# EAGLE design BOCASboard V2.1.3 (EAGLE 5.11)
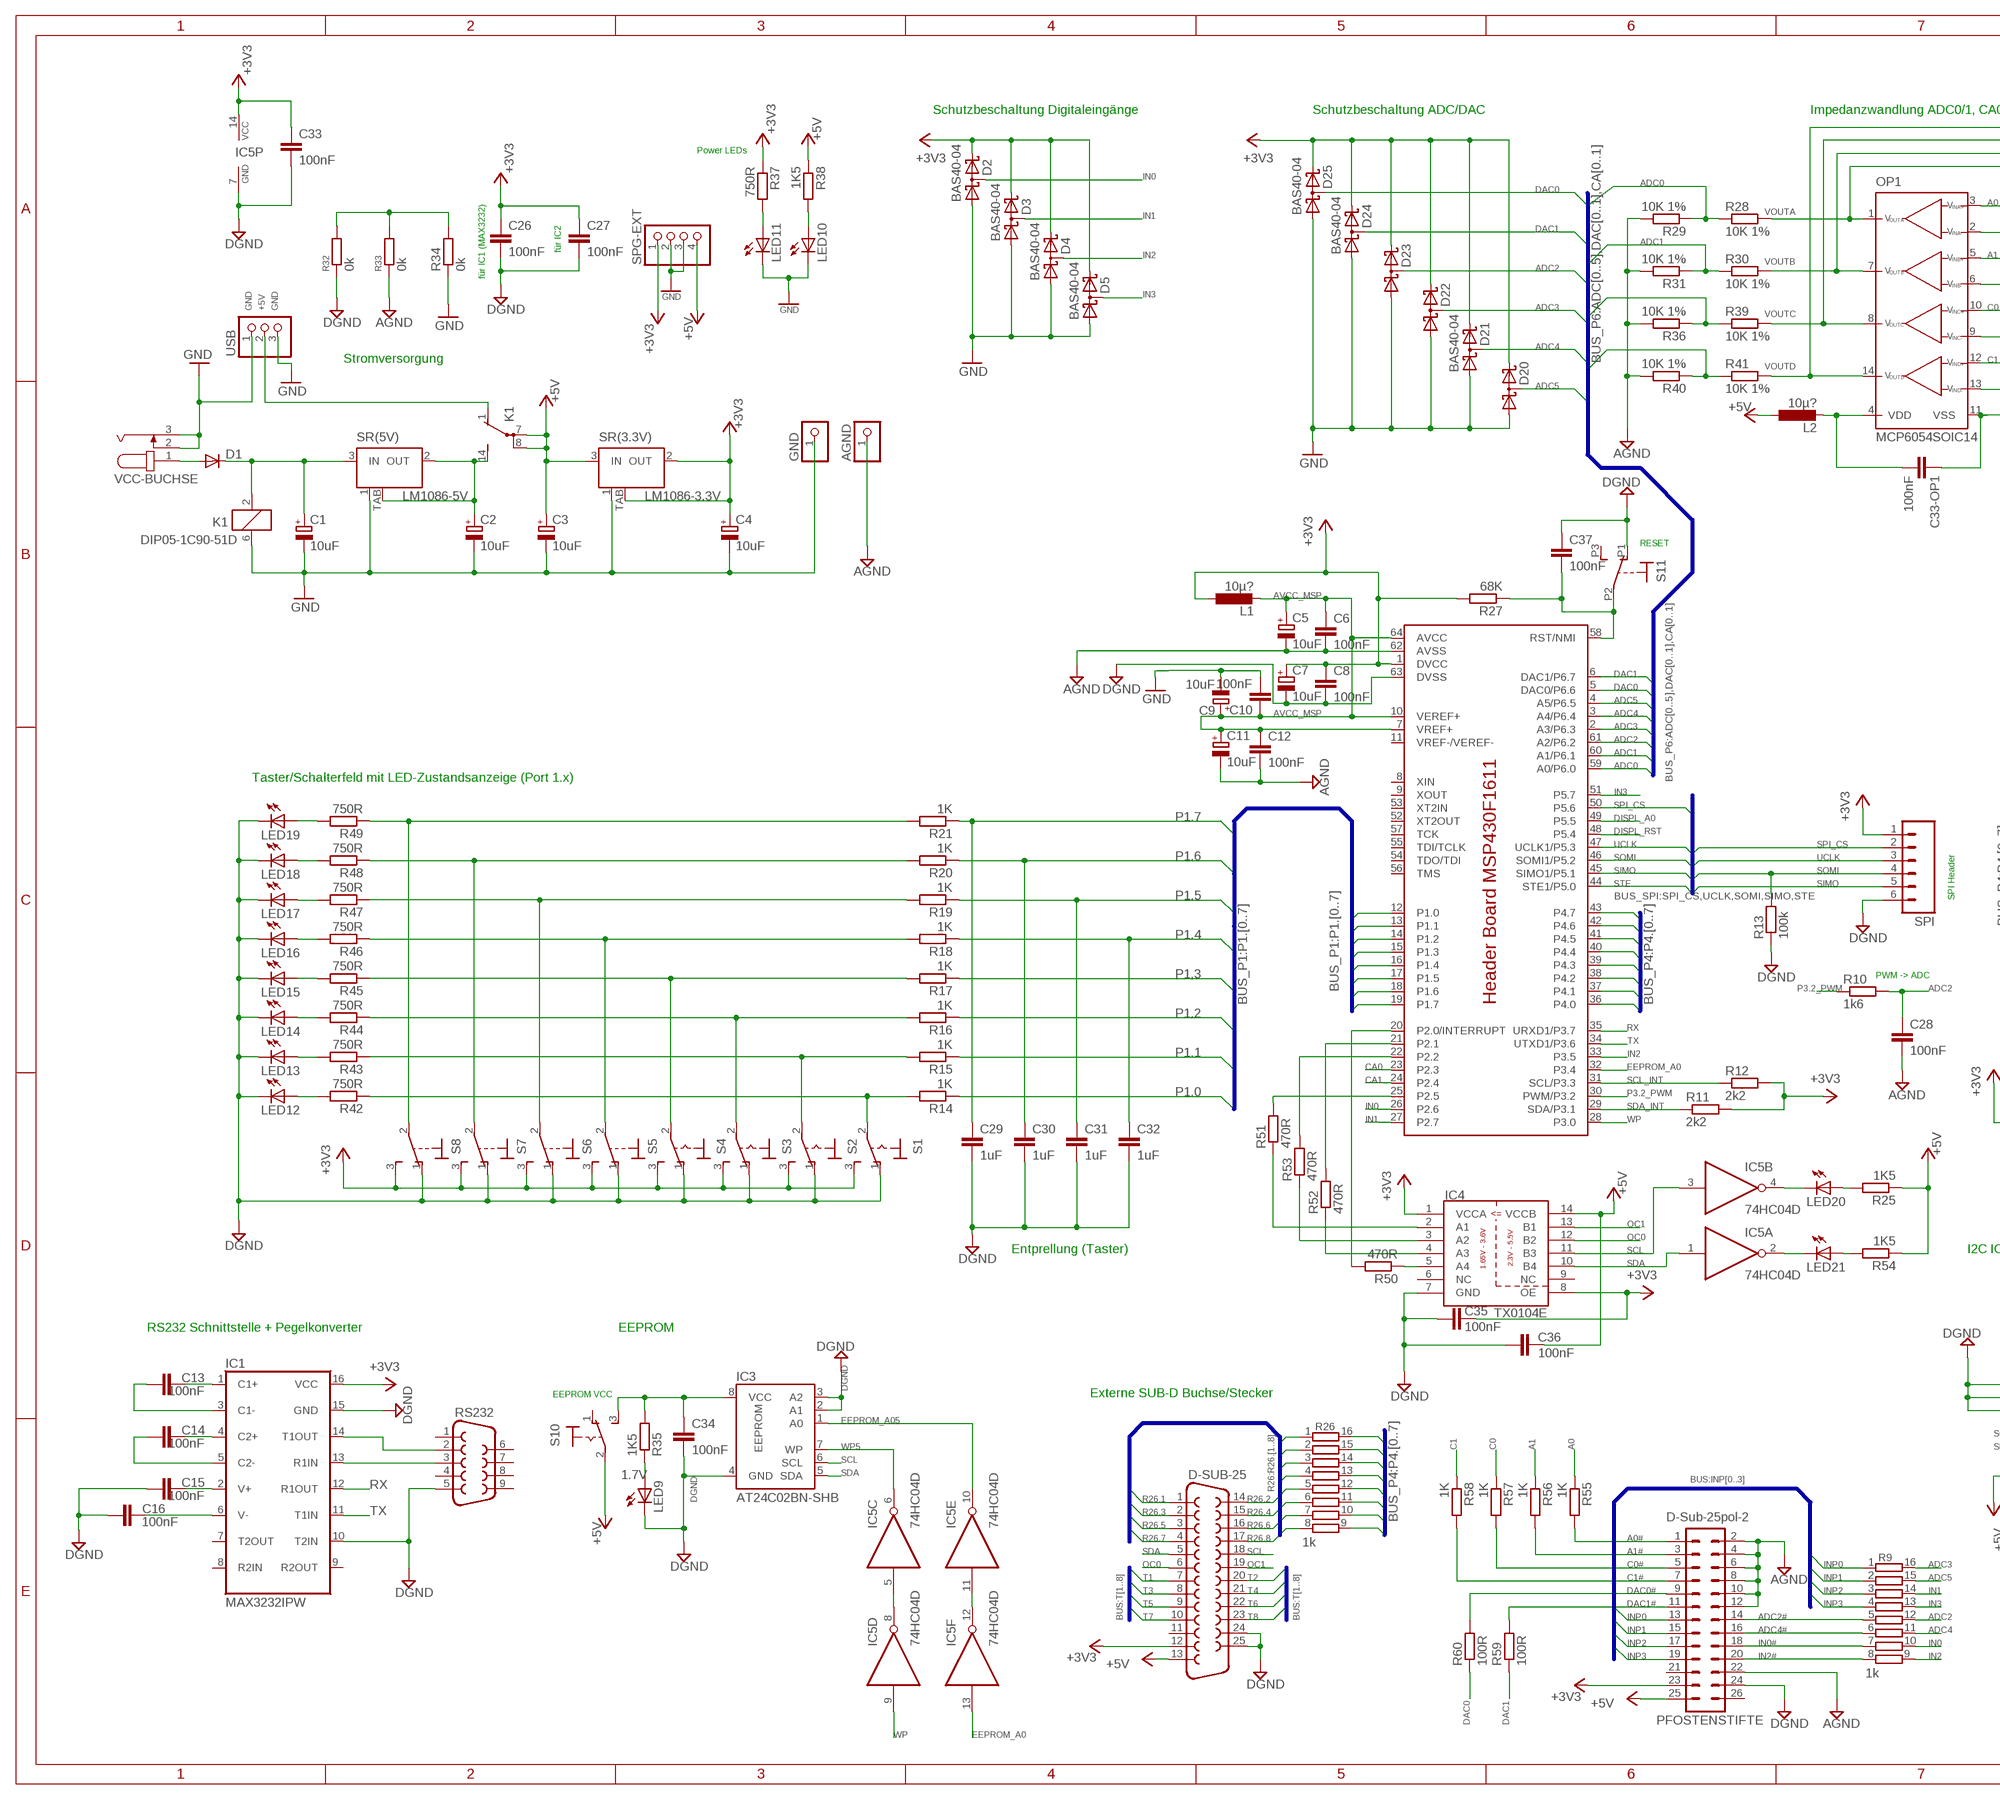
[diagram p0: schematic, sheet 1, part 1 of 2]
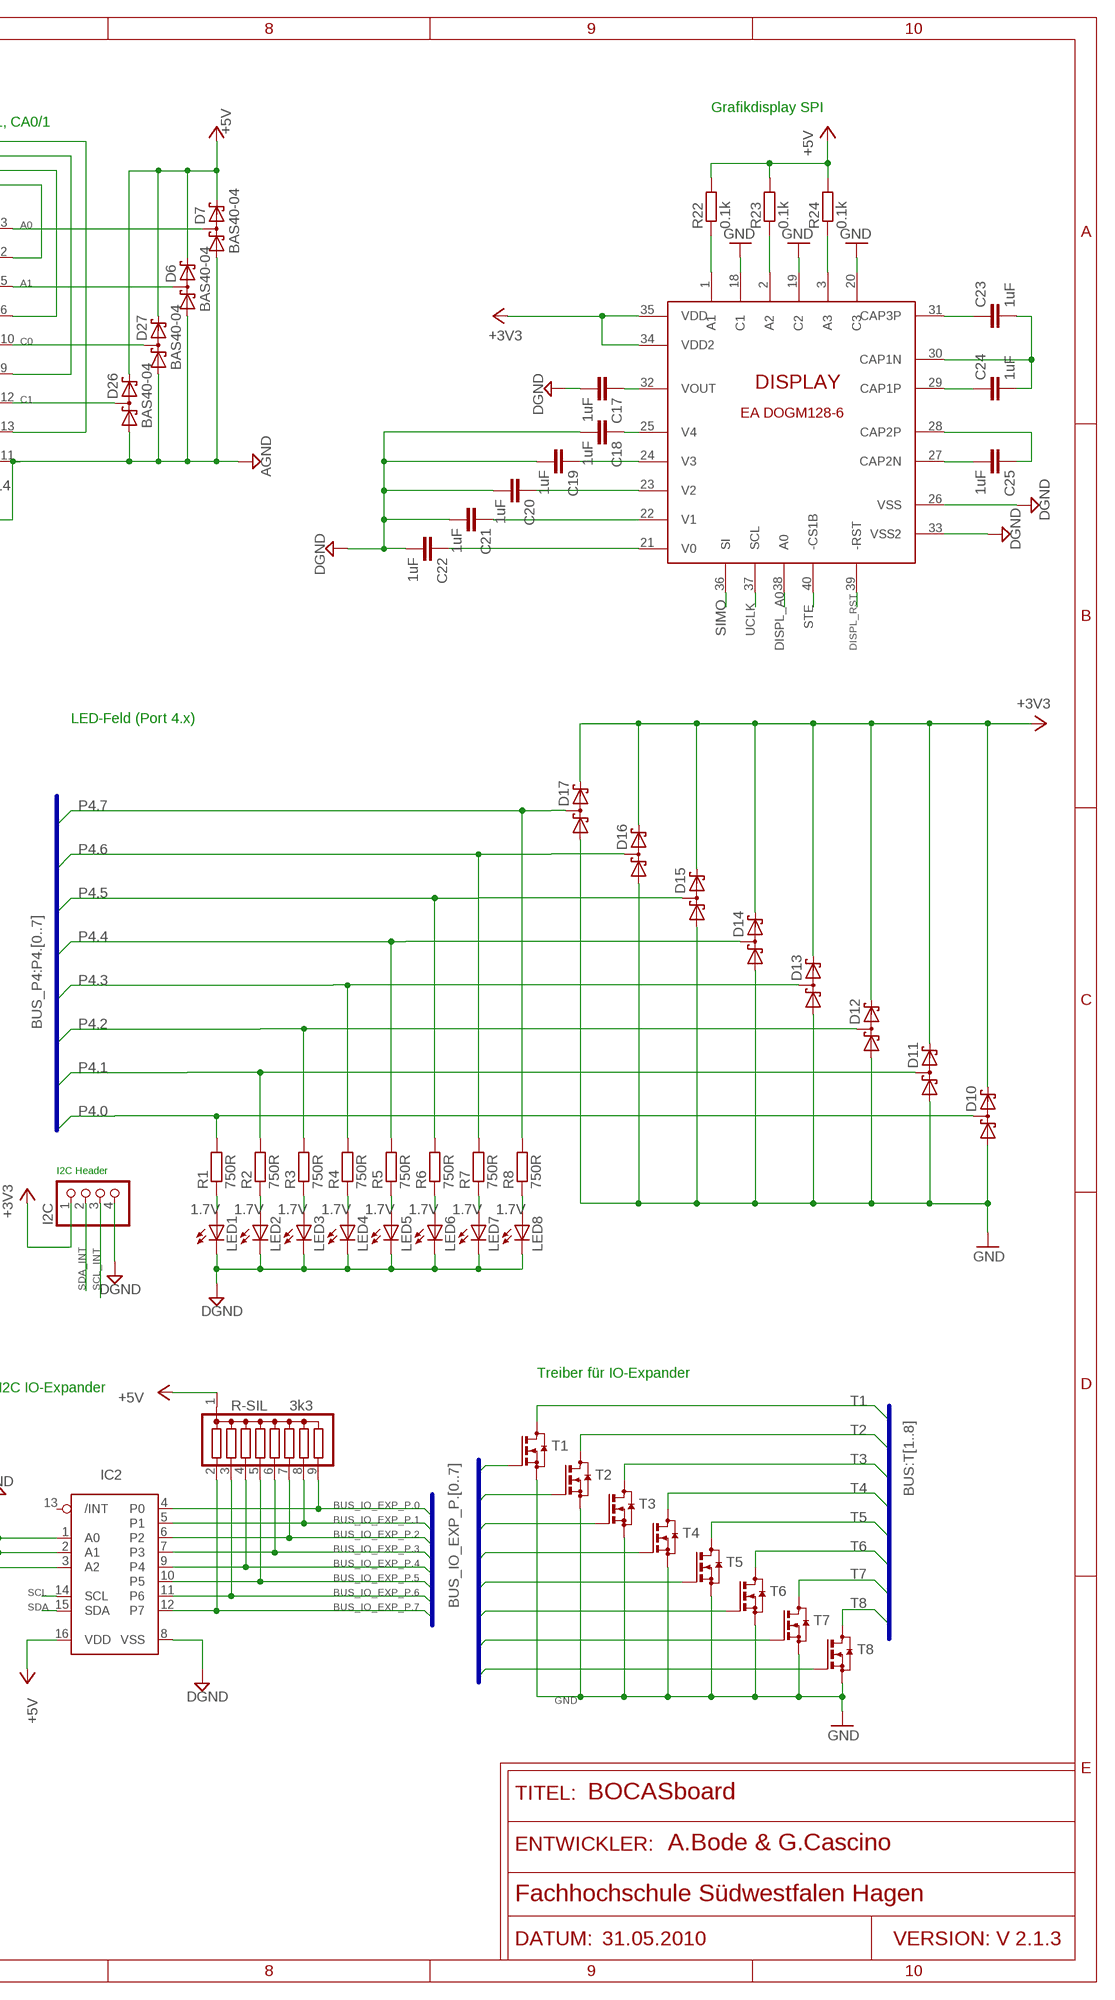
[diagram p1: schematic, sheet 1, part 2 of 2]

## Parts
AGND  PINHD-1X1  [1X01]
C1  10uF  KONDENSATORENCT3216  [CT3216]
C2  10uF  KONDENSATORENCT3216  [CT3216]
C3  10uF  KONDENSATORENCT3216  [CT3216]
C4  10uF  KONDENSATORENCT3216  [CT3216]
C5  10uF  KONDENSATORENCT3216  [CT3216]
C6  100nF  KONDENSATOR-  [R0805]
C7  10uF  KONDENSATORENCT3216  [CT3216]
C8  100nF  KONDENSATOR-  [R0805]
C9  10uF  KONDENSATORENCT3216  [CT3216]
C10  100nF  KONDENSATOR-  [R0805]
C11  10uF  KONDENSATORENCT3216  [CT3216]
C12  100nF  KONDENSATOR-  [R0805]
C13  100nF  KONDENSATOREN-KERAMIK  [C0805]
C14  100nF  KONDENSATOREN-KERAMIK  [C0805]
C15  100nF  KONDENSATOREN-KERAMIK  [C0805]
C16  100nF  KONDENSATOREN-KERAMIK  [C0805]
C17  1uF  KONDENSATOREN-KERAMIK  [C0805]
C18  1uF  KONDENSATOREN-KERAMIK  [C0805]
C19  1uF  KONDENSATOREN-KERAMIK  [C0805]
C20  1uF  KONDENSATOREN-KERAMIK  [C0805]
C21  1uF  KONDENSATOREN-KERAMIK  [C0805]
C22  1uF  KONDENSATOREN-KERAMIK  [C0805]
C23  1uF  KONDENSATOREN-KERAMIK  [C0805]
C24  1uF  KONDENSATOREN-KERAMIK  [C0805]
C25  1uF  KONDENSATOREN-KERAMIK  [C0805]
C26  100nF  KONDENSATOREN-KERAMIK  [C0805]
C27  100nF  KONDENSATOREN-KERAMIK  [C0805]
C28  100nF  KONDENSATOREN-KERAMIK  [C0805]
C29  1uF  KONDENSATOREN-KERAMIK  [C0805]
C30  1uF  KONDENSATOREN-KERAMIK  [C0805]
C31  1uF  KONDENSATOREN-KERAMIK  [C0805]
C32  1uF  KONDENSATOREN-KERAMIK  [C0805]
C33  100nF  KONDENSATOREN-KERAMIK  [C0805]
C33-OP1  100nF  KONDENSATOREN-KERAMIK  [C0805]
C34  100nF  KONDENSATOREN-KERAMIK  [C0805]
C35  100nF  KONDENSATOREN-KERAMIK  [C0805]
C36  100nF  KONDENSATOREN-KERAMIK  [C0805]
C37  100nF  KONDENSATOR-  [R0805]
D1  ES2D  [SMB]
D2  BAS40-04  [SOT23]
D3  BAS40-04  [SOT23]
D4  BAS40-04  [SOT23]
D5  BAS40-04  [SOT23]
D6  BAS40-04  [SOT23]
D7  BAS40-04  [SOT23]
D10  BAS40-04  [SOT23]
D11  BAS40-04  [SOT23]
D12  BAS40-04  [SOT23]
D13  BAS40-04  [SOT23]
D14  BAS40-04  [SOT23]
D15  BAS40-04  [SOT23]
D16  BAS40-04  [SOT23]
D17  BAS40-04  [SOT23]
D20  BAS40-04  [SOT23]
D21  BAS40-04  [SOT23]
D22  BAS40-04  [SOT23]
D23  BAS40-04  [SOT23]
D24  BAS40-04  [SOT23]
D25  BAS40-04  [SOT23]
D26  BAS40-04  [SOT23]
D27  BAS40-04  [SOT23]
D-SUB-25  D-SUB-25H  [F25-HORIZONTAL_2]
DISPLAY  EADOGM128  [EADOGM128]
GND  PINHD-1X1  [1X01]
I2C  PINHD-1X4  [1X04]
IC1  MAX3232IPW  [TSSOP16]
IC2  PCF8574AT  [SO16L]
IC3  AT24C02BN-SHB  [SOIC8]
IC4  TX0104E  TX0104PWR  [TSSOP14]
IC5  74HC04D  [SO14]
K1  DIP05-1C90-51D  [RR1U]
L1  10µ?  L-EUL0805  [R0805]
L2  10µ?  L-EUL0805  [R0805]
LED1  1.7V  LED3MM  [LED3MM]
LED2  1.7V  LED3MM  [LED3MM]
LED3  1.7V  LED3MM  [LED3MM]
LED4  1.7V  LED3MM  [LED3MM]
LED5  1.7V  LED3MM  [LED3MM]
LED6  1.7V  LED3MM  [LED3MM]
LED7  1.7V  LED3MM  [LED3MM]
LED8  1.7V  LED3MM  [LED3MM]
LED9  1.7V  LED3MM  [LED3MM]
LED10  LED  [R0805]
LED11  LED  [R0805]
LED12  LED  [R0805]
LED13  LED  [R0805]
LED14  LED  [R0805]
LED15  LED  [R0805]
LED16  LED  [R0805]
LED17  LED  [R0805]
LED18  LED  [R0805]
LED19  LED  [R0805]
LED20  LED  [R0805]
LED21  LED  [R0805]
OP1  MCP6054SOIC14  [SO14]
PFOSTENSTIFTE  D-Sub-25pol-2  PFOSTENSTIFTE  [ML26]
R1  750R  WIDERSTÄNDE_R0805  [R0805]
R2  750R  WIDERSTÄNDE_R0805  [R0805]
R3  750R  WIDERSTÄNDE_R0805  [R0805]
R4  750R  WIDERSTÄNDE_R0805  [R0805]
R5  750R  WIDERSTÄNDE_R0805  [R0805]
R6  750R  WIDERSTÄNDE_R0805  [R0805]
R7  750R  WIDERSTÄNDE_R0805  [R0805]
R8  750R  WIDERSTÄNDE_R0805  [R0805]
R9  1k  4816P-NETF  [SO16-F]
R10  1k6  WIDERSTÄNDE_R0805  [R0805]
R11  2k2  WIDERSTÄNDE_R0805  [R0805]
R12  2k2  WIDERSTÄNDE_R0805  [R0805]
R13  100k  WIDERSTÄNDE_R0805  [R0805]
R14  1K  WIDERSTÄNDE_R0805  [R0805]
R15  1K  WIDERSTÄNDE_R0805  [R0805]
R16  1K  WIDERSTÄNDE_R0805  [R0805]
R17  1K  WIDERSTÄNDE_R0805  [R0805]
R18  1K  WIDERSTÄNDE_R0805  [R0805]
R19  1K  WIDERSTÄNDE_R0805  [R0805]
R20  1K  WIDERSTÄNDE_R0805  [R0805]
R21  1K  WIDERSTÄNDE_R0805  [R0805]
R22  0.1k  WIDERSTÄNDE_R0805  [R0805]
R23  0.1k  WIDERSTÄNDE_R0805  [R0805]
R24  0.1k  WIDERSTÄNDE_R0805  [R0805]
R25  1K5  WIDERSTÄNDE_R0805  [R0805]
R26  1k  4816P-NETF  [SO16-F]
R27  68K  WIDERSTÄNDE_M0805  [M0805]
R28  10K 1%  WIDERSTÄNDE_R0805  [R0805]
R29  10K 1%  WIDERSTÄNDE_R0805  [R0805]
R30  10K 1%  WIDERSTÄNDE_R0805  [R0805]
R31  10K 1%  WIDERSTÄNDE_R0805  [R0805]
R32  0k  WIDERSTÄNDE_R0805  [R0805]
R33  0k  WIDERSTÄNDE_R0805  [R0805]
R34  0k  WIDERSTÄNDE_R0805  [R0805]
R35  1K5  WIDERSTÄNDE_R0805  [R0805]
R36  10K 1%  WIDERSTÄNDE_R0805  [R0805]
R37  750R  WIDERSTÄNDE_M0805  [M0805]
R38  1K5  WIDERSTÄNDE_M0805  [M0805]
R39  10K 1%  WIDERSTÄNDE_R0805  [R0805]
R40  10K 1%  WIDERSTÄNDE_R0805  [R0805]
R41  10K 1%  WIDERSTÄNDE_R0805  [R0805]
R42  750R  WIDERSTÄNDE_R0805  [R0805]
R43  750R  WIDERSTÄNDE_R0805  [R0805]
R44  750R  WIDERSTÄNDE_R0805  [R0805]
R45  750R  WIDERSTÄNDE_R0805  [R0805]
R46  750R  WIDERSTÄNDE_R0805  [R0805]
R47  750R  WIDERSTÄNDE_R0805  [R0805]
R48  750R  WIDERSTÄNDE_R0805  [R0805]
R49  750R  WIDERSTÄNDE_R0805  [R0805]
R50  470R  WIDERSTÄNDE_R0805  [R0805]
R51  470R  WIDERSTÄNDE_R0805  [R0805]
R52  470R  WIDERSTÄNDE_R0805  [R0805]
R53  470R  WIDERSTÄNDE_R0805  [R0805]
R54  1K5  WIDERSTÄNDE_R0805  [R0805]
R55  1K  WIDERSTÄNDE_R0805  [R0805]
R56  1K  WIDERSTÄNDE_R0805  [R0805]
R57  1K  WIDERSTÄNDE_R0805  [R0805]
R58  1K  WIDERSTÄNDE_R0805  [R0805]
R59  100R  WIDERSTÄNDE_R0805  [R0805]
R60  100R  WIDERSTÄNDE_R0805  [R0805]
R-SIL  3k3  BOURNS-4609  [SIL9]
RS232  D-SUB-09H  [F09-H1]
S1  KIPPSCHALTER  [2MS]
S2  KIPPSCHALTER  [2MS]
S3  KIPPSCHALTER  [2MS]
S4  KIPPSCHALTER  [2MS]
S5  KIPPTASTER  [2MS]
S6  KIPPTASTER  [2MS]
S7  KIPPTASTER  [2MS]
S8  KIPPTASTER  [2MS]
S10  KIPPSCHALTER  [2MS]
S11  RESET-KIPPTASTER  [KIPPTASTER-90]
SPG-EXT  PINHD-1X4  [1X04]
SPI  PFOSTENSTECKER-P06  [PFOSTENSTECKER-P06]
SR(3.3V)  LM1086-3.3V  [TO263-3]
SR(5V)  LM1086-5V  [TO263-3]
T1  N-MOSFET  [SOT346]
T2  N-MOSFET  [SOT346]
T3  N-MOSFET  [SOT346]
T4  N-MOSFET  [SOT346]
T5  N-MOSFET  [SOT346]
T6  N-MOSFET  [SOT346]
T7  N-MOSFET  [SOT346]
T8  N-MOSFET  [SOT346]
U$1  HEADER_BOARD_2  [MCKU]
USB  PINHD-1X3  [1X03]
VCC-BUCHSE  VCC-BUCHSE0  [VCC-BUCHSE-MULTIOCOMP]

## Nets
+3V3 [VCC +3.3V]: C4.+ C7.+ C8.1 C26.1 C27.1 C33.1 C35.1 D2.2(C2) D3.2(C2) D4.2(C2) D5.2(C2) D10.2(C2) D11.2(C2) D12.2(C2) D13.2(C2) D14.2(C2) D15.2(C2) D16.2(C2) D17.2(C2) D20.2(C2) D21.2(C2) D22.2(C2) D23.2(C2) D24.2(C2) D25.2(C2) D-SUB-25.12 DISPLAY.34(VDD2) DISPLAY.35(VDD) I2C.1 IC1.16(VCC) IC4.1(VCCA) IC4.8(OE) IC5.14(P:VCC) L1.1 PFOSTENSTIFTE.23 R11.2 R12.2 R27.2 R37.1 S1.3 S2.3 S3.3 S4.3 S5.3 S6.3 S7.3 S8.3 SPG-EXT.1 SPI.1 SR(3.3V).2(OUT) SR(3.3V).TAB(OUT) U$1.1(DVCC)
+5V [Power]: C3.+ C36.1 D6.2(C2) D7.2(C2) D26.2(C2) D27.2(C2) D-SUB-25.13 IC2.16(VDD) IC4.14(VCCB) K1.7(2:P) K1.8(2:P) L2.1 PFOSTENSTIFTE.25 R22.2 R23.2 R24.2 R25.1 R38.1 R54.1 R-SIL.1 S10.2 SPG-EXT.4 SR(3.3V).3(IN)
A0 [Analog]: D7.3(C1A2) OP1.3(VINA+) R55.1
A0# [Analog]: PFOSTENSTIFTE.1 R55.2
A1 [Analog]: D6.3(C1A2) OP1.5(VINB+) R56.1
A1# [Analog]: PFOSTENSTIFTE.3 R56.2
A2_TX: IC4.4(A3) R52.1
A3_TX: IC4.3(A2) R53.1
A4_TX: IC4.2(A1) R51.1
ADC0: R28.1 R29.1 U$1.59(A0/P6.0)
ADC1: R30.1 R31.1 U$1.60(A1/P6.1)
ADC2 [Analog]: C28.1 D23.3(C1A2) R9.12 R10.2 U$1.61(A2/P6.2)
ADC2#: PFOSTENSTIFTE.14 R9.5
ADC3 [Analog]: D22.3(C1A2) R9.16 U$1.2(A3/P6.3)
ADC4 [Analog]: D21.3(C1A2) R9.11 U$1.3(A4/P6.4)
ADC4#: PFOSTENSTIFTE.16 R9.6
ADC5 [Analog]: D20.3(C1A2) R9.15 U$1.4(A5/P6.5)
AGND [Power]: AGND.1 C5.- C6.2 C11.- C12.2 C28.2 C33-OP1.1 D6.1(A1) D7.1(A1) D26.1(A1) D27.1(A1) OP1.11(VSS) PFOSTENSTIFTE.2 PFOSTENSTIFTE.4 PFOSTENSTIFTE.6 PFOSTENSTIFTE.8 PFOSTENSTIFTE.10 PFOSTENSTIFTE.12 PFOSTENSTIFTE.22 R29.2 R31.2 R33.1 R36.2 R40.2 U$1.62(AVSS)
AVCC_MSP [VCC +3.3V]: C5.+ C6.1 C9.+ C10.1 C11.+ C12.1 L1.2 U$1.7(VREF+) U$1.10(VEREF+) U$1.64(AVCC)
BUS_IO_EXP_P.0 [Digital]: IC2.4(P0) R-SIL.9 T1.1(G)
BUS_IO_EXP_P.1 [Digital]: IC2.5(P1) R-SIL.8 T2.1(G)
BUS_IO_EXP_P.2 [Digital]: IC2.6(P2) R-SIL.7 T3.1(G)
BUS_IO_EXP_P.3 [Digital]: IC2.7(P3) R-SIL.6 T4.1(G)
BUS_IO_EXP_P.4 [Digital]: IC2.9(P4) R-SIL.4 T5.1(G)
BUS_IO_EXP_P.5 [Digital]: IC2.10(P5) R-SIL.5 T6.1(G)
BUS_IO_EXP_P.6: IC2.11(P6) R-SIL.3 T7.1(G)
BUS_IO_EXP_P.7 [Digital]: IC2.12(P7) R-SIL.2 T8.1(G)
C0: D27.3(C1A2) OP1.10(VINC+) R57.1
C0#: PFOSTENSTIFTE.5 R57.2
C1: D26.3(C1A2) OP1.12(VIND+) R58.1
C1#: PFOSTENSTIFTE.7 R58.2
C1+: C13.2 IC1.1(C1+)
C1-: C13.1 IC1.3(C1-)
C2+: C14.2 IC1.4(C2+)
CA0: R36.1 R39.1 U$1.23(P2.3)
CA1: R40.1 R41.1 U$1.24(P2.4)
DAC0: D25.3(C1A2) R60.1 U$1.5(DAC0/P6.6)
DAC0#: PFOSTENSTIFTE.9 R60.2
DAC1: D24.3(C1A2) R59.1 U$1.6(DAC1/P6.7)
DAC1#: PFOSTENSTIFTE.11 R59.2
DGND [Digital]: C7.- C8.2 C15.1 C16.1 C17.2 C18.2 C19.2 C20.2 C21.2 C22.2 C26.2 C27.2 C29.2 C30.2 C31.2 C32.2 C33.2 C34.2 C35.2 C36.2 C37.1 DISPLAY.26(VSS) DISPLAY.33(VSS2) I2C.4 IC1.10(T2IN) IC1.15(GND) IC2.1(A0) IC2.2(A1) IC2.3(A2) IC2.8(VSS) IC3.2(A1) IC3.3(A2) IC3.4(GND) IC4.7(GND) IC5.7(P:GND) LED1.K LED2.K LED3.K LED4.K LED5.K LED6.K LED7.K LED8.K LED9.K LED12.2(K) LED13.2(K) LED14.2(K) LED15.2(K) LED16.2(K) LED17.2(K) LED18.2(K) LED19.2(K) PFOSTENSTIFTE.24 R13.1 R32.1 RS232.5 S1.1 S2.1 S3.1 S4.1 S5.1 S6.1 S7.1 S8.1 S11.P1 SPI.6 U$1.63(DVSS)
DISPL_A0 [Digital]: DISPLAY.38(A0) U$1.49(P5.5)
DISPL_RST [Digital]: DISPLAY.39(-RST) U$1.48(P5.4)
EEPROM_A0 [Digital]: IC5.13(F:I) U$1.32(P3.4)
EEPROM_A05 [Digital]: IC3.1(A0) IC5.10(E:O)
GND [High Strom]: C1.- C2.- C3.- C4.- C9.- C10.2 D2.1(A1) D3.1(A1) D4.1(A1) D5.1(A1) D10.1(A1) D11.1(A1) D12.1(A1) D13.1(A1) D14.1(A1) D15.1(A1) D16.1(A1) D17.1(A1) D20.1(A1) D21.1(A1) D22.1(A1) D23.1(A1) D24.1(A1) D25.1(A1) DISPLAY.18(C1) DISPLAY.19(C2) DISPLAY.20(C3) GND.1 K1.6 LED10.2(K) LED11.2(K) R34.1 SPG-EXT.2 SPG-EXT.3 SR(3.3V).1(GND) SR(5V).1(GND) T1.2(S) T2.2(S) T3.2(S) T4.2(S) T5.2(S) T6.2(S) T7.2(S) T8.2(S) USB.1 USB.3 VCC-BUCHSE.2 VCC-BUCHSE.3
IN0: D2.3(C1A2) R9.10 U$1.26(P2.6)
IN0#: PFOSTENSTIFTE.18 R9.7
IN1: D3.3(C1A2) R9.14 U$1.27(P2.7)
IN2: D4.3(C1A2) R9.9 U$1.33(P3.5)
IN2#: PFOSTENSTIFTE.20 R9.8
IN3: D5.3(C1A2) R9.13 U$1.51(P5.7)
INP0: PFOSTENSTIFTE.13 R9.1
INP1: PFOSTENSTIFTE.15 R9.2
INP2: PFOSTENSTIFTE.17 R9.3
INP3: PFOSTENSTIFTE.19 R9.4
N$1: DISPLAY.1(A1) R22.1
N$2: R14.2 R42.1 S1.2
N$3: LED12.1(A) R42.2
N$4: DISPLAY.2(A2) R23.1
N$5: R50.2 U$1.20(P2.0/INTERRUPT)
N$6: LED19.1(A) R49.2
N$7: DISPLAY.3(A3) R24.1
N$8: LED18.1(A) R48.2
N$9: C23.1 DISPLAY.31(CAP3P)
N$10: LED17.1(A) R47.2
N$11: LED11.1(A) R37.2
N$12: LED10.1(A) R38.2
N$13: LED16.1(A) R46.2
N$14: LED15.1(A) R45.2
N$15: LED14.1(A) R44.2
N$16: C14.1 IC1.5(C2-)
N$17: D1.A VCC-BUCHSE.1
N$18: LED13.1(A) R43.2
N$19: R21.2 R49.1 S8.2
N$20: R20.2 R48.1 S7.2
N$21: R19.2 R47.1 S6.2
N$22: R18.2 R46.1 S5.2
N$23: C22.1 DISPLAY.21(V0)
N$24: C21.1 DISPLAY.22(V1)
N$25: C20.1 DISPLAY.23(V2)
N$26: C19.1 DISPLAY.24(V3)
N$27: LED1.A R1.1
N$28: LED2.A R2.1
N$29: LED3.A R3.1
N$30: LED4.A R4.1
N$31: LED5.A R5.1
N$32: LED6.A R6.1
N$33: LED7.A R7.1
N$34: LED8.A R8.1
N$35: C17.1 DISPLAY.32(VOUT)
N$36: C18.1 DISPLAY.25(V4)
N$37: C24.1 DISPLAY.29(CAP1P)
N$38: C23.2 C24.2 DISPLAY.30(CAP1N)
N$39: C25.2 DISPLAY.27(CAP2N)
N$40: C25.1 DISPLAY.28(CAP2P)
N$41: R17.2 R45.1 S4.2
N$42: R32.2 R33.2 R34.2
N$43: LED9.A R35.1
N$44: R16.2 R44.1 S3.2
N$45: R15.2 R43.1 S2.2
N$46: R52.2 U$1.21(P2.1)
N$47: IC4.5(A4) R50.1
N$48: R51.2 U$1.25(P2.5)
N$50: C15.2 IC1.2(V+)
N$51 [Power]: C33-OP1.2 L2.2 OP1.4(VDD)
N$53: R53.2 U$1.22(P2.2)
N$55: IC5.4(B:O) LED20.2(K)
N$56: IC5.2(A:O) LED21.2(K)
N$57: LED21.1(A) R54.2
N$58: LED20.1(A) R25.2
N$59: IC5.11(E:I) IC5.12(F:O)
N$61: IC5.5(C:I) IC5.8(D:O)
NAME [Digital]: D-SUB-25.24 D-SUB-25.25 ; supply symbol labelled DGND
OC0: D-SUB-25.6 IC4.12(B2)
OC1: D-SUB-25.19 IC4.13(B1)
OUT+5V [Power]: C2.+ K1.14(2:S) SR(5V).2(OUT) SR(5V).TAB(OUT)
P1.0 [Digital]: R14.1 U$1.12(P1.0)
P1.1 [Digital]: R15.1 U$1.13(P1.1)
P1.2 [Digital]: R16.1 U$1.14(P1.2)
P1.3 [Digital]: R17.1 U$1.15(P1.3)
P1.4 [Digital]: C32.1 R18.1 U$1.16(P1.4)
P1.5 [Digital]: C31.1 R19.1 U$1.17(P1.5)
P1.6 [Digital]: C30.1 R20.1 U$1.18(P1.6)
P1.7 [Digital]: C29.1 R21.1 U$1.19(P1.7)
P3.2_PWM [Digital]: R10.1 U$1.30(PWM/P3.2)
P4.0 [Digital]: D10.3(C1A2) R1.2 R26.16 U$1.36(P4.0)
P4.1 [Digital]: D11.3(C1A2) R2.2 R26.15 U$1.37(P4.1)
P4.2 [Digital]: D12.3(C1A2) R3.2 R26.14 U$1.38(P4.2)
P4.3 [Digital]: D13.3(C1A2) R4.2 R26.13 U$1.39(P4.3)
P4.4 [Digital]: D14.3(C1A2) R5.2 R26.12 U$1.40(P4.4)
P4.5 [Digital]: D15.3(C1A2) R6.2 R26.11 U$1.41(P4.5)
P4.6 [Digital]: D16.3(C1A2) R7.2 R26.10 U$1.42(P4.6)
P4.7 [Digital]: D17.3(C1A2) R8.2 R26.9 U$1.43(P4.7)
PWR-5 [Power]: C1.+ D1.C K1.2 SR(5V).3(IN)
R1IN [Digital]: IC1.13(R1IN) RS232.3
R26.1: D-SUB-25.1 R26.1
R26.2: D-SUB-25.14 R26.2
R26.3: D-SUB-25.2 R26.3
R26.4: D-SUB-25.15 R26.4
R26.5: D-SUB-25.3 R26.5
R26.6: D-SUB-25.16 R26.6
R26.7: D-SUB-25.4 R26.7
R26.8: D-SUB-25.17 R26.8
RX [Digital]: IC1.12(R1OUT) U$1.35(URXD1/P3.7)
S10: C37.2 R27.1 S11.P2 U$1.58(RST/NMI)
SCL [Digital]: D-SUB-25.18 IC2.14(SCL) IC3.6(SCL) IC4.11(B3) IC5.3(B:I)
SCL_INT [Digital]: I2C.3 R12.1 U$1.31(SCL/P3.3)
SDA [Digital]: D-SUB-25.5 IC2.15(SDA) IC3.5(SDA) IC4.10(B4) IC5.1(A:I)
SDA_INT [Digital]: I2C.2 R11.1 U$1.29(SDA/P3.1)
SIMO: DISPLAY.36(SI) SPI.5 U$1.45(SIMO1/P5.1)
SOMI: R13.2 SPI.4 U$1.46(SOMI1/P5.2)
SPI_CS: SPI.2 U$1.50(P5.6)
STE: DISPLAY.40(-CS1B) U$1.44(STE1/P5.0)
T1 [High Strom]: D-SUB-25.7 T1.3(D)
T1OUT [Digital]: IC1.14(T1OUT) RS232.2
T2 [High Strom]: D-SUB-25.20 T2.3(D)
T3 [High Strom]: D-SUB-25.8 T3.3(D)
T4 [High Strom]: D-SUB-25.21 T4.3(D)
T5 [High Strom]: D-SUB-25.9 T5.3(D)
T6 [High Strom]: D-SUB-25.22 T6.3(D)
T7 [High Strom]: D-SUB-25.10 T7.3(D)
T8 [High Strom]: D-SUB-25.23 T8.3(D)
TX [Digital]: IC1.11(T1IN) U$1.34(UTXD1/P3.6)
UCLK: DISPLAY.37(SCL) SPI.3 U$1.47(UCLK1/P5.3)
USB [Power]: K1.1(2:O) USB.2
V-: C16.2 IC1.6(V-)
VCC-EEPROM [Digital]: C34.1 IC3.8(VCC) R35.2 S10.3
VOUTA: OP1.1(VOUTA) OP1.2(VINA-) R28.2
VOUTB: OP1.6(VINB-) OP1.7(VOUTB) R30.2
VOUTC: OP1.8(VOUTC) OP1.9(VINC-) R39.2
VOUTD: OP1.13(VIND-) OP1.14(VOUTD) R41.2
WP [Digital]: IC5.9(D:I) U$1.28(P3.0)
WP5 [Digital]: IC3.7(WP) IC5.6(C:O)
Unconnected: D-SUB-25.11 IC1.7(T2OUT) IC1.8(R2IN) IC1.9(R2OUT) IC2.13(/INT) IC4.6(NC) IC4.9(NC) PFOSTENSTIFTE.21 PFOSTENSTIFTE.26 RS232.1 RS232.4 RS232.6 RS232.7 RS232.8 RS232.9 S10.1 S11.P3 U$1.8(XIN) U$1.9(XOUT) U$1.11(VREF-/VEREF-) U$1.52(XT2OUT) U$1.53(XT2IN) U$1.54(TDO/TDI) U$1.55(TDI/TCLK) U$1.56(TMS) U$1.57(TCK)

## Buses
BUS_P1:P1.[0..7]
BUS_IO_EXP_P.[0..7]
BUS_SPI:SPI_CS,UCLK,SOMI,SIMO,STE
BUS:T[1..8]
R26:R26.[1..8]
BUS_P4:P4.[0..7]
BUS_P6:ADC[0..5],DAC[0..1],CA[0..1]
BUS:INP[0..3]

## Notes on the sheet
- Grafikdisplay SPI
- Schutzbeschaltung Digitaleingänge | Schutzbeschaltung ADC/DAC | Impedanzwandlung ADC0/1, CA0/1
- Power LEDs
- für IC2
- für IC1 (MAX3232)
- GND | +5V | GND
- Stromversorgung
- RESET
- LED-Feld (Port 4.x)
- Taster/Schalterfeld mit LED-Zustandsanzeige (Port 1.x)
- SPI Header
- PWM -> ADC
- I2C Header
- Treiber für IO-Expander
- Entprellung (Taster) | I2C IO-Expander
- RS232 Schnittstelle + Pegelkonverter | EEPROM
- EEPROM VCC | Externe SUB-D Buchse/Stecker
- EEPROM
- TITEL: | BOCASboard
- ENTWICKLER: | A.Bode & G.Cascino
- Fachhochschule Südwestfalen Hagen
- DATUM: | 31.05.2010 | VERSION: V 2.1.3

## Library data of the parts
AGND GND = Projekt:PINHD-1X1: PIN HEADER
C1-C5 C7 C9 C11 = Projekt:KONDENSATOREN: POLARIZED CAPACITOR, European symbol
C6 C8 C10 C12 C37 = Projekt:KONDENSATOR-: CAPACITOR, European symbol
C13-C33 C33-OP1 C34-C36 = Projekt:KONDENSATOREN-KERAMIK: Keramik Kondensator,
D1 = Projekt:ES2D: DIODE super fast rectifier, 2 A
D2-D7 D10-D17 D20-D27 = Projekt:BAS40-04: Silicon Schottky Diodes General-purpose diode for high-speed switching
D-SUB-25 = Projekt:D-SUB-25H: Multicomp 5504F1 - Series
DISPLAY = Projekt:EADOGM128
I2C SPG-EXT = Projekt:PINHD-1X4: PIN HEADER
IC1 = Projekt:MAX3232: Texas Instruments RS-232 Transceivers Supply-Current, True +3V to +5.5V
IC2 = Projekt:PCF8574: Remote 8-Bit I/O Expander for I²C Bus
IC3 = Projekt:AT24C*: 2-wire serial EEPROM
IC4 = Projekt:TX0104: TXB0104 or TXS0104 TXB0104 4-BIT BIDIRECTIONAL VOLTAGE-LEVEL TRANSLATOR WITH AUTOMATIC DIRECTION SENSING AND ±15-kV ESD PROTECTION FEATURES 1.2 V to 3.6 V on A Port and 1.65 V to 5.5 V on B Port (VCCA <= VCCB) VCC Isolation Feature - If Either VCC Input Is at GND, All Outputs Are in the High-Impedance State OE Input Circuit Referenced to VCCA Low Power Consumption, 5-uA Max ICC Ioff Supports Partial-Power-Down Mode Operation TXS0104 4-BIT BIDIRECTIONAL VOLTAGE-LEVEL TRANSLATOR FOR OPEN-DRAIN AND PUSH-PULL APPLICATIONS
IC5 = 74xx-eu:74*04: Hex INVERTER
K1 = Projekt:DIP05: REED-RELAY Meder Reed, 1 x Wechselkontakt
L1 L2 = Projekt:L-EU: INDUCTOR, European symbol
LED1-LED21 = Projekt:LED: LED OSRAM: KINGBRIGHT: L-934LSRD 3mm Source: www.kingbright.com
OP1 = Projekt:MCP6054: Operationsverstärker Microchip MCP 6052
PFOSTENSTIFTE = Projekt:PFOSTENSTIFTE: Pfostenstifte
R1-R8 R10-R25 R27-R60 = Projekt:WIDERSTÄNDE_: RESISTOR, European symbol
R9 R26 = Projekt:4816P-NET: BOURNS RESISTOR NETWORK
R-SIL = Projekt:BOURNS-: BOURNS 4609X-SIL Widerstand
RS232 = Projekt:D-SUB-09H
S1-S4 S10 = Projekt:KIPPSCHALTER: MULTICOMP SWITCH Kippschalter ein-ein
S5-S8 = Projekt:KIPPTASTER: MULTICOMP SWITCH Kipptaster ein-tast
S11 = Projekt:RESET-KIPPTASTER: Multicomp Kipptaster gewinkelt, ein-tast
SPI = Projekt:PFOSTENSTECKER-P06
SR(3.3V) = Projekt:LM1086-3.3V: National Semiconductor LM1086-3.3V 1.5A Low Dropout Positive Regulators
SR(5V) = Projekt:LM1086-5V: National Semiconductor LM1086-5V 1.5A Low Dropout Positive Regulators
T1-T8 = Projekt:N-MOSFET: Sanyo CPH3430 N-CHANNEL MOSFET
U$1 = Projekt:HEADER_BOARD_2: Texas Instruments MSP430F1611
USB = Projekt:PINHD-1X3: PIN HEADER
VCC-BUCHSE = Projekt:VCC-BUCHSE: DC Buchse 2.35mm Multicomp

## Net classes
1 Power: width 0.61 mm, drill 0.406 mm, clearance 0.203 mm
2 High Strom: width 1.016 mm, drill 0.508 mm, clearance 0.203 mm
3 Digital: width 0.152 mm, drill 0.305 mm, clearance 0.152 mm
4 Analog: width 0.508 mm, drill 0.305 mm, clearance 0.203 mm
5 VCC +3.3V: width 0.406 mm, drill 0.305 mm, clearance 0.203 mm

## Board
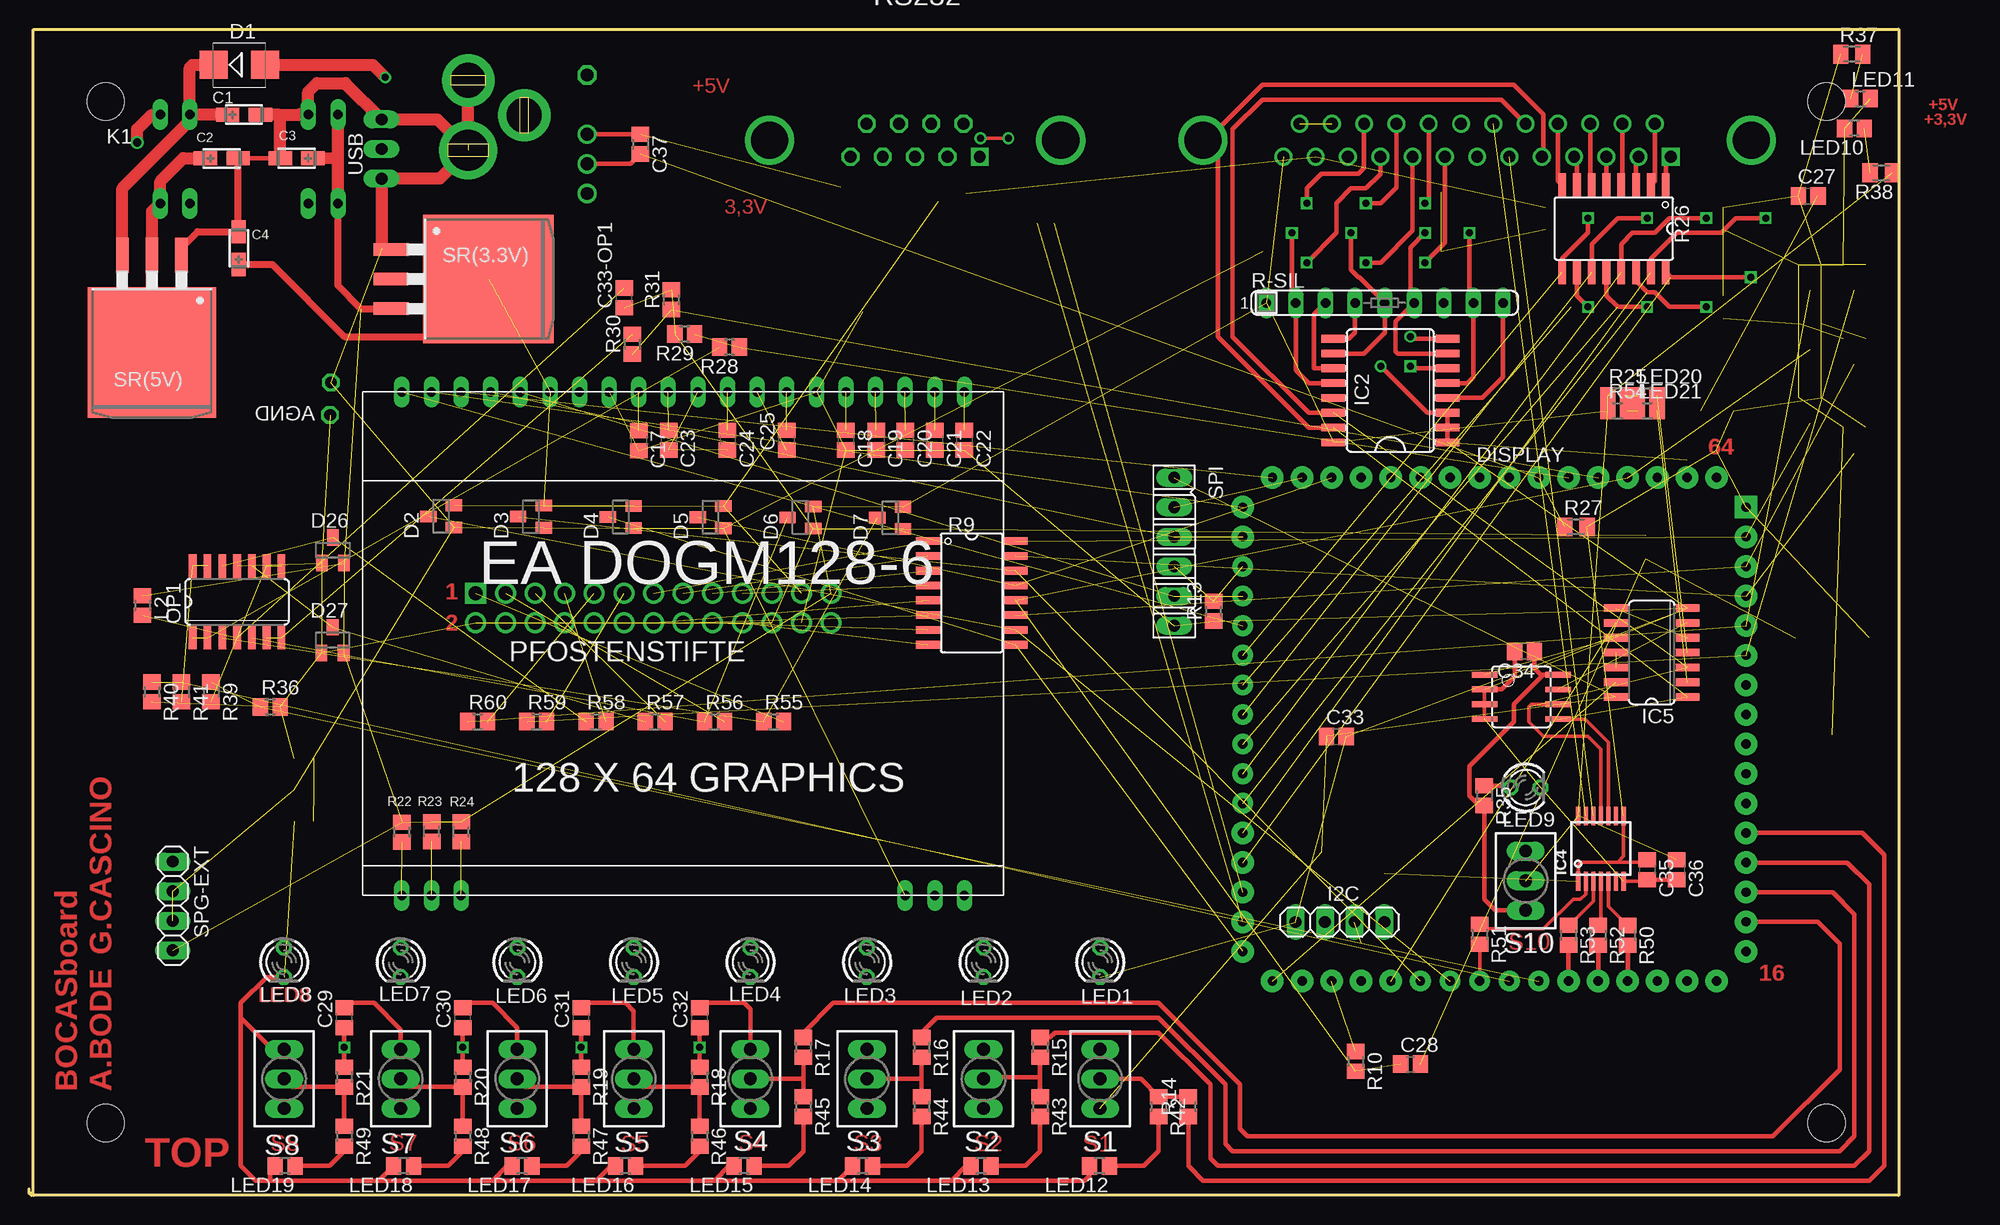
[diagram p2: board, top side]
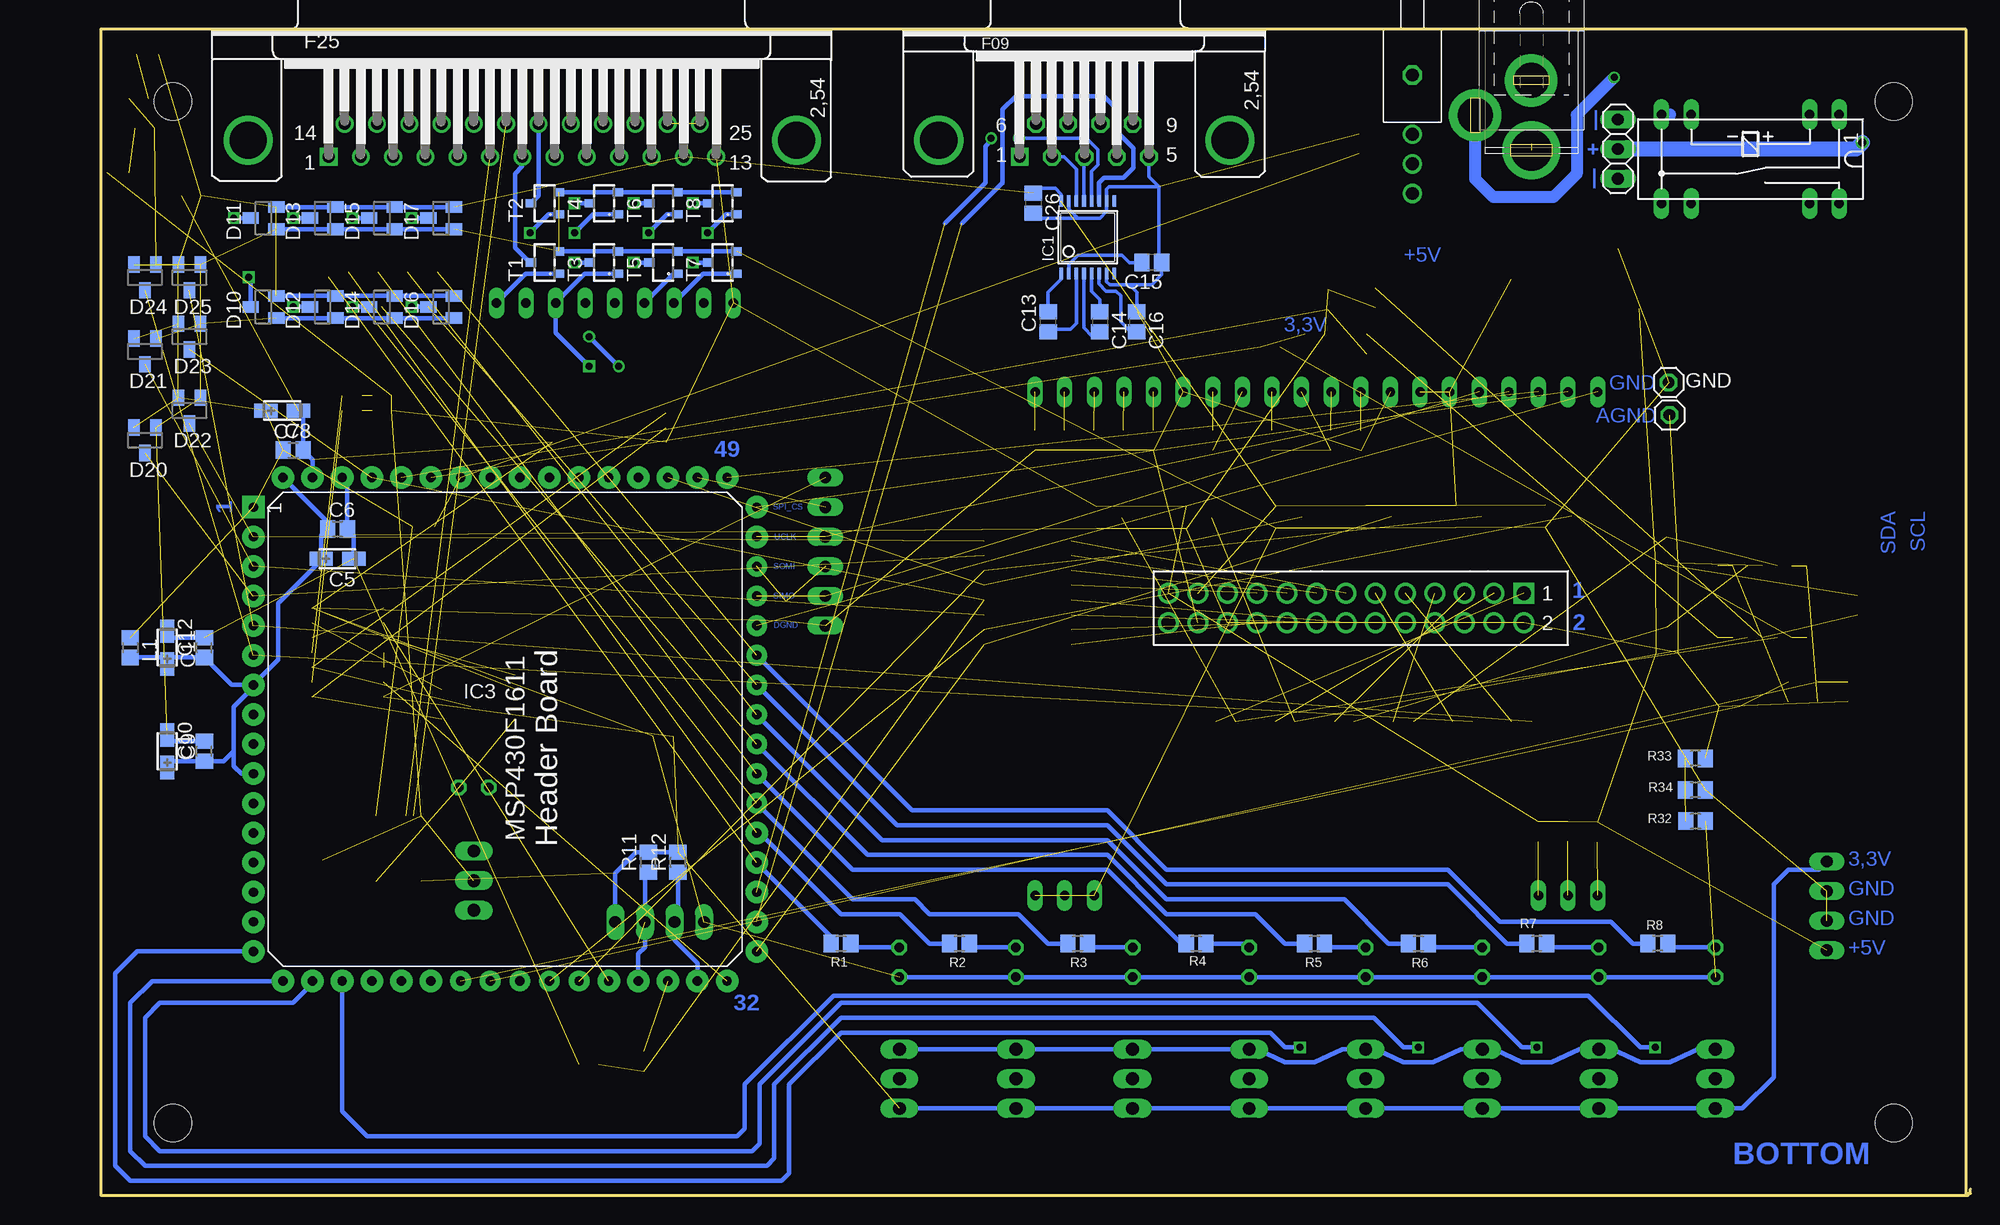
[diagram p3: board, bottom side, seen from below]

Size 160.37 x 100.02 mm. Coordinates in mm from the lower left corner, seen from the top.
Outline: 160.37,100 0.37,100
Outline: 0.37,0 0.37,100
Outline: 0.37,100 160.34,100.02 160.37,100
Outline: 160.37,100 160.37,0 0.37,0
Outline: 0.37,0 0.18,0 0.18,0.18 0,0.18 0,0.56
Copper layers (1*16): Top 0.035mm / dielectric 1.5mm / Bottom 0.035mm
Design rules "default *": minimum track width 6mil, minimum drill 12mil, track to track 8mil, track to pad 8mil, pad to pad 8mil, via to via 8mil, smd to smd 8mil, copper to edge 40mil, drill to drill 8mil, minimum pad ring 10mil, minimum via ring 8mil, stop-mask expansion 4mil, vias tented up to drill 0mil, thermal gap 10mil
Holes 3.2 mm at 6.57,93.8 6.57,6.2 154.17,6.2 154.17,93.8

### Footprints (pad centres in the part's own frame; a part is rotated, then mirrored left to right if it is on the bottom)
1X01 = drill 1.016 octagon: 1 0,0
CT3216 = smd 2 x 1.2: + 1.4,0; - -1.4,0
R0805 = smd 1.3 x 1.5: 1 -0.85,0; 2 0.85,0
C0805 = smd 1.3 x 1.5: 1 -0.85,0; 2 0.85,0
SMB = smd 2.4 x 2.4: A 2.2,0; C -2.2,0
SOT23 = smd 1 x 1.4: 1 -0.95,-1.1; 2 0.95,-1.1; 3 0,1.1
F25-HORIZONTAL_2 = drill 1.016 square: 1 16.62,10.92 | drill 1.016 round: 2 13.85,10.92; 3 11.08,10.92; 4 8.31,10.92; 5 5.54,10.92; 6 2.77,10.92; 7 0,10.92; 8 -2.77,10.92; 9 -5.54,10.92; 10 -8.31,10.92; 11 -11.08,10.92; 12 -13.85,10.92; 13 -16.62,10.92; 14 15.235,8.08; 15 12.465,8.08; 16 9.695,8.08; 17 6.925,8.08; 18 4.155,8.08; 19 1.385,8.08; 20 -1.385,8.08; 21 -4.155,8.08; 22 -6.925,8.08; 23 -9.695,8.08; 24 -12.465,8.08; 25 -15.235,8.08 | drill 3.2 round: P$1 -23.52,9.5; P$2 23.52,9.5
EADOGM128 = drill 0.8 long: 1 -24.13,-21.59; 2 -21.59,-21.59; 3 -19.05,-21.59; 18 19.05,-21.59; 19 21.59,-21.59; 20 24.13,-21.59; 21 24.13,21.59; 22 21.59,21.59; 23 19.05,21.59; 24 16.51,21.59; 25 13.97,21.59; 26 11.43,21.59; 27 8.89,21.59; 28 6.35,21.59; 29 3.81,21.59; 30 1.27,21.59; 31 -1.27,21.59; 32 -3.81,21.59; 33 -6.35,21.59; 34 -8.89,21.59; 35 -11.43,21.59; 36 -13.97,21.59; 37 -16.51,21.59; 38 -19.05,21.59; 39 -21.59,21.59; 40 -24.13,21.59
1X04 = drill 1.016 long: 1 -3.81,0; 2 -1.27,0; 3 1.27,0; 4 3.81,0
TSSOP16 = smd 0.305 x 0.991: 1 -2.275,-3.1; 2 -1.625,-3.1; 3 -0.975,-3.1; 4 -0.325,-3.1; 5 0.325,-3.1; 6 0.975,-3.1; 7 1.625,-3.1; 8 2.275,-3.1; 9 2.275,3.1; 10 1.625,3.1; 11 0.975,3.1; 12 0.325,3.1; 13 -0.325,3.1; 14 -0.975,3.1; 15 -1.625,3.1; 16 -2.275,3.1
SO16L = smd 0.66 x 2.032: 1 -4.445,-4.902; 2 -3.175,-4.902; 3 -1.905,-4.902; 4 -0.635,-4.902; 5 0.635,-4.902; 6 1.905,-4.902; 7 3.175,-4.902; 8 4.445,-4.902; 9 4.445,4.902; 10 3.175,4.902; 11 1.905,4.902; 12 0.635,4.902; 13 -0.635,4.902; 14 -1.905,4.902; 15 -3.175,4.902; 16 -4.445,4.902
SOIC8 = smd 0.5 x 2.2: 1 -1.905,-3.154; 2 -0.645,-3.154; 3 0.625,-3.154; 4 1.895,-3.154; 5 1.905,3.154; 6 0.635,3.154; 7 -0.635,3.154; 8 -1.905,3.154
TSSOP14 = smd 0.35 x 1.6: 1 -1.95,-2.8; 2 -1.3,-2.8; 3 -0.65,-2.8; 4 0,-2.8; 5 0.65,-2.8; 6 1.3,-2.8; 7 1.95,-2.8; 8 1.95,2.8; 9 1.3,2.8; 10 0.65,2.8; 11 0,2.8; 12 -0.65,2.8; 13 -1.3,2.8; 14 -1.95,2.8
SO14 = smd 0.66 x 2.032: 1 -3.81,-3.073; 2 -2.54,-3.073; 3 -1.27,-3.073; 4 0,-3.073; 5 1.27,-3.073; 6 2.54,-3.073; 7 3.81,-3.073; 8 3.81,3.073; 9 2.54,3.073; 10 1.27,3.073; 11 0,3.073; 12 -1.27,3.073; 13 -2.54,3.073; 14 -3.81,3.073
RR1U = drill 0.813 long: 1 -7.62,-3.81; 2 -5.08,-3.81; 6 5.08,-3.81; 7 7.62,-3.81; 8 7.62,3.81; 9 5.08,3.81; 13 -5.08,3.81; 14 -7.62,3.81
LED3MM = drill 0.813 octagon: A -1.27,0; K 1.27,0
ML26 = drill 1.2 square: 1 -15.24,-1.27 | drill 1.2 round: 2 -15.24,1.27; 3 -12.7,-1.27; 4 -12.7,1.27; 5 -10.16,-1.27; 6 -10.16,1.27; 7 -7.62,-1.27; 8 -7.62,1.27; 9 -5.08,-1.27; 10 -5.08,1.27; 11 -2.54,-1.27; 12 -2.54,1.27; 13 0,-1.27; 14 0,1.27; 15 2.54,-1.27; 16 2.54,1.27; 17 5.08,-1.27; 18 5.08,1.27; 19 7.62,-1.27; 20 7.62,1.27; 21 10.16,-1.27; 22 10.16,1.27; 23 12.7,-1.27; 24 12.7,1.27; 25 15.24,-1.27; 26 15.24,1.27
SO16-F = smd 0.66 x 2.032: 1 -4.445,-3.748; 2 -3.175,-3.748; 3 -1.905,-3.748; 4 -0.635,-3.748; 5 0.635,-3.748; 6 1.905,-3.748; 7 3.175,-3.748; 8 4.445,-3.748; 9 4.445,3.748; 10 3.175,3.748; 11 1.905,3.748; 12 0.635,3.748; 13 -0.635,3.748; 14 -1.905,3.748; 15 -3.175,3.748; 16 -4.445,3.748
M0805 = smd 1.3 x 1.6: 1 -0.95,0; 2 0.95,0
SIL9 = drill 0.813 long: 1 -10.16,0; 2 -7.62,0; 3 -5.08,0; 4 -2.54,0; 5 0,0; 6 2.54,0; 7 5.08,0; 8 7.62,0; 9 10.16,0
F09-H1 = drill 1.016 square: 1 5.54,10.92 | drill 1.016 octagon: 2 2.77,10.92; 3 0,10.92; 4 -2.77,10.92; 5 -5.54,10.92; 6 4.155,8.08; 7 1.385,8.08; 8 -1.385,8.08; 9 -4.155,8.08 | drill 3.2 round: P$1 -12.495,9.5; P$2 12.495,9.5
2MS = drill 1.1 pad 1.422 long: 1 -2.54,0; 2 0,0; 3 2.54,0
KIPPTASTER-90 = drill 1.1 round: P1 0,2.54; P2 0,5.08; P3 0,7.62 | drill 1.1 octagon: P$4 0,-2.54
PFOSTENSTECKER-P06 = drill 1.016 long: 1 -6.35,0; 2 -3.81,0; 3 -1.27,0; 4 1.27,0; 5 3.81,0; 6 6.35,0
TO263-3 = smd 1.067 x 3: 1 -2.54,-5.791; 2 0,-5.791; 3 2.54,-5.791 | smd 11 x 11.2: TAB 0,2.54
SOT346 = smd 0.7 x 0.9: 1 -0.95,-1.2; 2 0.95,-1.2; 3 0,1.2
MCKU = drill 0.8 pad 1.93 square: 1 -22.86,-20.32 | drill 0.8 pad 1.93 round: 2 -20.32,-20.32; 3 -17.78,-20.32; 4 -15.24,-20.32; 5 -12.7,-20.32; 6 -10.16,-20.32; 7 -7.62,-20.32; 8 -5.08,-20.32; 9 -2.54,-20.32; 10 0,-20.32; 11 2.54,-20.32; 12 5.08,-20.32; 13 7.62,-20.32; 14 10.16,-20.32; 15 12.7,-20.32; 16 15.24,-20.32; 17 17.78,-17.78; 18 17.78,-15.24; 19 17.78,-12.7; 20 17.78,-10.16; 21 17.78,-7.62; 22 17.78,-5.08; 28 17.78,10.16; 29 17.78,12.7; 30 17.78,15.24; 31 17.78,17.78; 32 17.78,20.32; 33 15.24,22.86; 34 12.7,22.86; 35 10.16,22.86; 36 7.62,22.86; 37 5.08,22.86; 47 -20.32,22.86; 48 -22.86,22.86; 49 -25.4,20.32; 50 -25.4,17.78; 51 -25.4,15.24; 52 -25.4,12.7; 53 -25.4,10.16; 54 -25.4,7.62; 55 -25.4,5.08; 56 -25.4,2.54; 57 -25.4,0; 58 -25.4,-2.54; 59 -25.4,-5.08; 60 -25.4,-7.62; 61 -25.4,-10.16; 62 -25.4,-12.7; 63 -25.4,-15.24; 64 -25.4,-17.78 | drill 0.8 pad 1.778 round: 23 17.78,-2.54; 24 17.78,0; 25 17.78,2.54; 26 17.78,5.08; 27 17.78,7.62; 38 2.54,22.86; 39 0,22.86; 40 -2.54,22.86; 41 -5.08,22.86; 42 -7.62,22.86; 43 -10.16,22.86; 44 -12.7,22.86; 45 -15.24,22.86; 46 -17.78,22.86
1X03 = drill 1.016 long: 1 -2.54,0; 2 0,0; 3 2.54,0
VCC-BUCHSE-MULTIOCOMP = drill 3 pad 4.5 round: 1 0,-4.8; 2 -3,0 | drill 3.5 pad 5 round: 3 3,0

### Placement (x,y rotation side)
AGND  25.81,66.93 0 bottom
C1  18.43,92.7 180 top
C2  16.53,88.93 180 top
C3  22.95,88.95 0 top
C4  17.98,81.25 270 top
C5  140.07,54.61 180 bottom
C6  140.07,57.15 0 bottom
C7  144.81,67.31 180 bottom
C8  143.87,63.92 0 bottom
C9  154.67,38.1 270 bottom
C10  151.5,38.1 90 bottom
C11  154.67,46.99 270 bottom
C12  151.5,46.99 90 bottom
C13  79.11,74.93 90 bottom
C14  74.66,74.93 270 bottom
C15  70.22,80.01 180 bottom
C16  71.49,74.93 270 bottom
C17  52.29,64.73 270 top
C18  70.06,64.78 270 top
C19  72.65,64.78 270 top
C20  75.17,64.78 270 top
C21  77.69,64.78 270 top
C22  80.23,64.78 270 top
C23  54.86,64.78 270 top
C24  59.91,64.78 270 top
C25  64.98,64.78 90 top
C26  80.38,85.09 270 bottom
C27  152.6,85.73 0 top
C28  118.5,11.26 0 top
C29  27.04,15.24 90 top
C30  37.2,15.24 90 top
C31  47.36,15.24 90 top
C32  57.52,15.24 90 top
C33  112.13,39.37 0 top
C33-OP1  51.05,76.97 90 top
C34  128.28,46.64 180 top
C35  138.8,27.94 270 top
C36  141.34,27.94 270 top
C37  52.44,90.17 270 top
D1  18.05,96.97 0 top
D2  35.34,58.24 90 top
D3  43.05,58.22 90 top
D4  50.75,58.19 90 top
D5  58.46,58.17 90 top
D6  66.16,58.14 90 top
D7  73.87,58.12 90 top
D10  146.42,76.2 90 bottom
D11  146.42,83.82 90 bottom
D12  141.34,76.2 90 bottom
D13  141.34,83.82 90 bottom
D14  136.26,76.2 90 bottom
D15  136.26,83.82 90 bottom
D16  131.18,76.2 90 bottom
D17  131.18,83.82 90 bottom
D20  156.58,64.77 180 bottom
D21  156.58,72.39 180 bottom
D22  152.77,67.31 180 bottom
D23  152.77,73.66 180 bottom
D24  156.58,78.74 180 bottom
D25  152.77,78.74 180 bottom
D26  26.06,55.34 0 top
D27  26.03,47.63 0 top
D-SUB-25  124.21,100 180 bottom
DISPLAY  56.1,47.32 0 top
GND  25.88,69.72 0 bottom
I2C  112.43,23.45 180 top
IC1  75.71,82.18 0 bottom
IC2  116.77,69.03 90 top
IC3  128,42.76 270 top
IC4  134.82,29.75 0 top
IC5  139.19,46.56 90 top
K1  18.87,88.9 180 bottom
L1  157.85,46.99 270 bottom
L2  9.72,50.6 270 top
LED1  91.87,20 270 top
LED2  81.87,20 270 top
LED3  71.87,20 270 top
LED4  61.87,20 270 top
LED5  51.87,20 270 top
LED6  41.87,20 270 top
LED7  31.87,20 270 top
LED8  21.87,20 270 top
LED9  128.37,35 0 top
LED10  156.58,91.52 180 top
LED11  157.09,94.06 0 top
LED12  91.81,2.54 180 top
LED13  81.65,2.54 180 top
LED14  71.49,2.54 180 top
LED15  61.33,2.54 180 top
LED16  51.17,2.54 180 top
LED17  42.28,2.54 180 top
LED18  32.12,2.54 180 top
LED19  21.96,2.54 180 top
LED20  138.8,68.58 0 top
LED21  138.8,67.31 0 top
OP1  17.84,50.91 0 top
PFOSTENSTIFTE  53.56,50.37 180 bottom
R1  96.89,21.59 180 bottom
R2  86.73,21.59 180 bottom
R3  76.57,21.59 180 bottom
R4  66.41,21.59 180 bottom
R5  56.25,21.59 180 bottom
R6  47.36,21.59 180 bottom
R7  37.2,21.59 180 bottom
R8  26.81,21.6 180 bottom
R9  80.86,51.68 270 top
R10  113.79,11.5 270 top
R11  113.4,28.57 90 bottom
R12  110.86,28.57 90 bottom
R13  101.61,50.11 90 top
R14  99.43,7.62 90 top
R15  86.73,12.7 270 top
R16  76.57,12.7 270 top
R17  66.41,12.7 270 top
R18  57.52,10.16 270 top
R19  47.36,10.16 270 top
R20  37.2,10.16 270 top
R21  27.04,10.16 270 top
R22  31.98,31.16 90 top
R23  34.53,31.21 90 top
R24  37.06,31.19 90 top
R25  136.26,68.58 0 top
R26  135.94,82.92 180 top
R27  132.69,57.33 0 top
R28  60.07,72.75 180 top
R29  56.24,73.87 180 top
R30  51.76,73.01 90 top
R31  55.1,76.83 90 top
R32  23.57,32.1 180 bottom
R33  23.59,37.49 180 bottom
R34  23.59,34.78 180 bottom
R35  124.83,34.29 270 top
R36  20.69,41.91 0 top
R37  156.34,97.87 0 top
R38  158.87,87.71 180 top
R39  15.61,43.18 270 top
R40  10.53,43.18 270 top
R41  13.07,43.18 270 top
R42  96.89,7.62 270 top
R43  86.73,7.62 270 top
R44  76.57,7.62 270 top
R45  66.41,7.62 270 top
R46  57.52,5.08 270 top
R47  47.36,5.08 270 top
R48  37.2,5.08 270 top
R49  27.04,5.08 270 top
R50  137.12,22.3 270 top
R51  124.43,22.41 270 top
R52  134.58,22.32 270 top
R53  132.04,22.33 270 top
R54  136.26,67.31 0 top
R55  63.87,40.64 0 top
R56  58.79,40.64 0 top
R57  53.71,40.64 0 top
R58  48.63,40.64 0 top
R59  43.55,40.64 0 top
R60  38.47,40.64 0 top
R-SIL  116.28,76.56 0 top
RS232  76,100 180 bottom
S1  91.87,10 270 top
S2  81.87,10 270 top
S3  71.87,10 270 top
S4  61.87,10 270 top
S5  51.87,10 270 top
S6  41.87,10 270 top
S7  31.87,10 270 top
S8  21.87,10 270 top
S10  128.37,27 270 top
S11  47.87,93.55 180 bottom
SPG-EXT  12.32,24.83 270 top
SPI  98.22,55.22 270 top
SR(3.3V)  36.86,78.59 270 top
SR(5V)  10.53,74.84 180 top
T1  122.29,80.01 90 bottom
T2  122.29,85.09 90 bottom
T3  117.21,80.01 90 bottom
T4  117.21,85.09 90 bottom
T5  112.13,80.01 90 bottom
T6  112.13,85.09 90 bottom
T7  107.05,80.01 90 bottom
T8  107.05,85.09 90 bottom
U$1  126.97,36.17 270 bottom
USB  30.22,89.74 270 bottom
VCC-BUCHSE  37.66,92.64 270 bottom

### Tracks (layer width: path | path; a pad name or v marks a point on that pad's centre or on a via)
+3V3  (30 unrouted)
  Top 0.305: IC4.1 132.87,28.36 133.08,28.57 136.26,28.57 | 136.26,28.57 138.58,28.57 C35.1 | IC4.8 136.77,29.09 136.26,28.57
  Top 0.406: 34.46,73.66 SR(3.3V).TAB
  Top 0.61: C4.+ 20.85,79.84 27.04,73.66 34.46,73.66
  Top 1.016: SR(3.3V).TAB SR(3.3V).2
  Bottom 0.305: IC1.16 77.99,85.87 78.47,86.36 79.96,86.36 C26.1
  Bottom 0.406: S1.3 S2.3 S3.3 S4.3 S5.3 S6.3 S7.3 S8.3 19.58,7.46 16.88,10.16 16.88,26.67 15.61,27.94 13.02,27.94 SPG-EXT.1 | D16.2 D14.2 D12.2 D10.2 | D11.2 D13.2 D15.2 D17.2 | R12.2 R11.2 114.45,29.43 116.24,27.64 I2C.1
+5V  (19 unrouted)
  Top 0.61: K1.8 26.49,78.02 28.46,76.05 SR(3.3V).3
  Top 1.016: K1.7 K1.8 26.5,88.9 C3.+
  Bottom 1.016: K1.7 25.77,92.71
A0  (2 unrouted)
A0#  (1 unrouted)
A1  (2 unrouted)
A1#  (1 unrouted)
A2_TX
  Top 0.305: 134.17,23.58 R52.1 134.82,23.42 IC4.4
A3_TX
  Top 0.305: IC4.3 134.17,25.22 132.13,23.18 R53.1
A4_TX
  Top 0.305: R51.1 124.83,22.86 129.91,22.86 132.45,25.4 133.08,25.4 133.52,25.84 IC4.2
ADC0  (2 unrouted)
ADC1  (2 unrouted)
ADC2  (4 unrouted)
ADC2#  (1 unrouted)
ADC3  (2 unrouted)
ADC4  (2 unrouted)
ADC4#  (1 unrouted)
ADC5  (2 unrouted)
AGND  (21 unrouted)
  Bottom 0.406: U$1.62 139.22,61.12 C6.2 138.67,56.6 C5.- | C12.2 154.12,47.84 C11.-
AVCC_MSP
  Bottom 0.406: U$1.64 140.92,57.74 C6.1 141.47,56.6 C5.+ 141.47,54.48 145.15,50.8 145.15,45.93 U$1.7 | U$1.7 147.29,43.58 148.96,41.91 148.96,38.1 | U$1.10 148.3,36.17 148.96,36.83 148.96,38.1 | 148.96,38.1 149.81,37.25 C10.1 154.12,37.25 C9.+ | U$1.7 149.15,43.79 C12.1 154.12,46.14 C11.+ 155.22,46.14 L1.2
BUS_IO_EXP_P.0
  Top 0.406: IC2.4 124.65,68.4 126.44,70.19 R-SIL.9
  Bottom 0.406: T1.1 123.93,79.06 R-SIL.9
BUS_IO_EXP_P.1  (via drill 0.6)
  Top 0.406: v123.56,82.55 123.56,76.89 R-SIL.8 123.9,70.19 123.38,69.67 IC2.5
  Bottom 0.406: T2.1 121.97,84.14 v123.56,82.55
BUS_IO_EXP_P.2  (via drill 0.6)
  Top 0.406: IC2.6 118.66,70.94 v118.48,71.12
  Bottom 0.406: T3.1 118.85,79.06 R-SIL.7 121.36,74 v118.48,71.12
BUS_IO_EXP_P.3  (via drill 0.6)
  Top 0.406: v119.75,82.55 118.48,81.28 118.48,76.89 R-SIL.6 117.21,74.95 117.21,72.39 117.39,72.21 IC2.7
  Bottom 0.406: T4.1 118.16,84.14 v119.75,82.55
BUS_IO_EXP_P.4
  Top 0.406: R-SIL.4 113.74,74 113.22,73.48 IC2.9
  Bottom 0.406: T5.1 111.23,79.06 R-SIL.4
BUS_IO_EXP_P.5  (via drill 0.6)
  Top 0.406: v113.4,82.55 113.4,79.38 114.03,78.74 114.09,78.74 R-SIL.5 116.28,74 114.49,72.21 IC2.10
  Bottom 0.406: T6.1 111.81,84.14 v113.4,82.55
BUS_IO_EXP_P.6
  Top 0.406: IC2.11 110.22,70.94 110.22,75.58 R-SIL.3
  Bottom 0.406: T7.1 108.69,79.06 R-SIL.3
BUS_IO_EXP_P.7  (via drill 0.6)
  Top 0.406: v108.32,82.55 108.32,76.89 R-SIL.2 108.66,70.78 109.77,69.67 IC2.12
  Bottom 0.406: T8.1 106.73,84.14 v108.32,82.55
C0  (2 unrouted)
C0#  (1 unrouted)
C1  (2 unrouted)
C1#  (1 unrouted)
C1+
  Bottom 0.305: IC1.1 77.99,78.59 79.11,77.47 C13.2
C1-
  Bottom 0.305: IC1.3 76.69,74.81 77.2,74.3 78.89,74.3 C13.1
C2+
  Bottom 0.305: IC1.4 76.04,74.4 75.3,73.66 75.08,73.66 C14.2
CA0  (2 unrouted)
CA1  (2 unrouted)
DAC0  (2 unrouted)
DAC0#  (1 unrouted)
DAC1  (2 unrouted)
DAC1#  (1 unrouted)
DGND  (via drill 0.6)  (23 unrouted)
  Top 0.305: IC4.7 138.66,26.95 C35.2 C36.2 | IC3.4 IC3.3 IC3.2
  Top 0.406: LED12.2 90.96,1.69 90.54,1.27 79.11,1.27 | 69.37,1.27 79.11,1.27 | 69.37,1.27 LED14.2 | LED13.2 80.38,2.54 79.11,1.27 | 30,1.27 39.74,1.27 | 39.74,1.27 48.63,1.27 | 48.63,1.27 58.79,1.27 | 58.79,1.27 69.37,1.27 | 30,1.27 LED18.2 | LED17.2 41.01,2.54 39.74,1.27 | LED16.2 49.9,2.54 48.63,1.27 | LED15.2 60.06,2.54 58.79,1.27 | 20.69,1.27 30,1.27 | 20.69,1.27 20.69,2.12 LED19.2 | S4.1 61.87,15.97 61.33,16.51 57.94,16.51 C32.2 | S5.1 51.87,15.81 51.17,16.51 47.78,16.51 C31.2 | S6.1 41.87,14.38 39.74,16.51 37.62,16.51 C30.2 | LED8.K 20.37,18.73 18.15,16.51 18.15,15.24 | 18.15,15.24 18.15,2.54 19.42,1.27 20.69,1.27 | S8.1 20.85,12.54 18.15,15.24 | C29.2 27.04,16.51 29.58,16.51 31.87,14.22 S7.1 | IC2.1 IC2.2 IC2.3 119.93,67.13 v115.94,71.12 | C37.1 47.88,91.02 S11.P1 | IC2.8 118.66,73.48 v118.48,73.66 | C36.2 139.22,27.09 138.8,26.67 | C34.2 127.43,44.51 126.33,43.41 IC3.2
  Bottom 0.305: 70.47,89.07 RS232.5 70.46,87.37 69.58,86.49 | IC1.15 77.33,85.1 77.33,84.58 76.57,83.82 | 73.43,86.49 73.89,86.49 74.09,86.29 74.09,85.1 IC1.10 74.09,84.4 74.66,83.82 76.57,83.82 | 73.43,86.49 73.44,86.49 | 74.09,78.71 74.09,78.38 73.82,78.11 72.12,78.11 | 71.27,76 C16.1 71.49,77.48 72.12,78.11 | 72.12,78.11 70.22,78.11 69.37,78.96 C15.1 69.58,80.22 69.58,86.49 | 69.58,86.49 73.43,86.49 | 76.57,83.82 79.96,83.82 C26.2
  Bottom 0.406: S1.1 S2.1 S3.1 S4.1 61.17,12.54 58.79,11.43 56.25,11.43 53.87,12.54 S5.1 51.01,12.54 48.63,11.43 46.09,11.43 43.71,12.54 S6.1 40.85,12.54 38.47,11.43 35.93,11.43 33.55,12.54 S7.1 30.69,12.54 28.31,11.43 25.77,11.43 23.39,12.54 S8.1 | LED8.K LED7.K LED6.K LED5.K LED4.K LED3.K LED2.K LED1.K | v115.94,71.12 v118.48,73.66 | U$1.63 142.21,63.1 C8.2 143.02,66.92 C7.-
DISPL_A0  (1 unrouted)
DISPL_RST  (1 unrouted)
EEPROM_A0  (1 unrouted)
EEPROM_A05  (1 unrouted)
GND  (25 unrouted)
  Top 0.406: C2.- 21.53,88.94 C3.- | 17.96,82.66 17.93,82.7 | SR(5V).1 13.07,81.28
  Top 0.61: 17.93,82.7 C2.- | 17.96,82.66 14.45,82.66 13.07,81.28
  Top 1.016: K1.6 23.23,92.71 23.21,92.7 21.37,92.7 | 17.96,82.66 C4.- | K1.6 23.27,92.75 | 37.66,90.18 37.66,90.19 VCC-BUCHSE.2 | SR(3.3V).1 30.22,81.18 USB.3 35.22,87.2 VCC-BUCHSE.3 35.02,92.28 USB.1 27.11,95.39 24.68,95.39 23.95,94.66 K1.6 | 21.37,92.7 C1.- | C3.- 21.55,92.52 21.37,92.7
  Bottom 0.406: T8.2 T6.2 T4.2 T2.2 | T1.2 T3.2 T5.2 T7.2 | D12.1 D10.1 | D12.1 140.24,75.1 140.07,74.93 | D12.1 D14.1 D16.1 | D17.1 D15.1 D13.1 D11.1 | C10.2 154.12,38.95 C9.-
IN0  (2 unrouted)
IN0#  (1 unrouted)
IN1  (2 unrouted)
IN2  (2 unrouted)
IN2#  (1 unrouted)
IN3  (2 unrouted)
INP0  (1 unrouted)
INP1  (1 unrouted)
INP2  (1 unrouted)
INP3  (1 unrouted)
N$1  (1 unrouted)
N$2
  Top 0.406: S1.2 95.36,10 R42.1 R14.2
N$3
  Top 0.406: R42.2 96.89,3.81 95.62,2.54 LED12.1
N$4  (1 unrouted)
N$5
  Top 0.406: U$1.20 R50.2
N$6
  Top 0.406: R49.2 27.04,3.81 25.77,2.54 LED19.1
N$7  (1 unrouted)
N$8
  Top 0.406: R48.2 37.2,3.81 35.93,2.54 LED18.1
N$9  (1 unrouted)
N$10
  Top 0.406: R47.2 47.36,3.81 46.09,2.54 LED17.1
N$11  (1 unrouted)
N$12  (1 unrouted)
N$13
  Top 0.406: R46.2 57.52,3.81 56.25,2.54 LED16.1
N$14
  Top 0.406: R45.2 66.41,3.81 65.14,2.54 LED15.1
N$15
  Top 0.406: R44.2 76.57,3.81 75.3,2.54 LED14.1
N$16
  Bottom 0.305: IC1.5 75.39,77.56 74.66,76.83 C14.1
N$17  (via drill 0.6)
  Top 1.016: D1.A 29.47,96.97 v30.55,95.88
  Bottom 1.016: v30.56,95.88 v30.55,95.88 33.76,92.67 33.76,87.62 35.77,85.61 40.9,85.61 42.46,87.17 VCC-BUCHSE.1
N$18
  Top 0.406: R43.2 86.73,3.81 85.46,2.54 LED13.1
N$19
  Top 0.406: R49.1 R21.2 22.56,9.31 S8.2
N$20
  Top 0.406: S7.2 32.56,9.31 R20.2 R48.1
N$21
  Top 0.406: S6.2 42.56,9.31 R19.2 R47.1
N$22
  Top 0.406: R46.1 R18.2 52.56,9.31 S5.2
N$23  (1 unrouted)
N$24  (1 unrouted)
N$25  (1 unrouted)
N$26  (1 unrouted)
N$27
  Bottom 0.406: LED1.A 95.72,21.27 R1.1
N$28
  Bottom 0.406: LED2.A 85.56,21.27 R2.1
N$29
  Bottom 0.406: LED3.A 75.4,21.27 R3.1
N$30
  Bottom 0.406: R4.1 62.19,21.59 LED4.A
N$31
  Bottom 0.406: LED5.A 55.08,21.27 R5.1
N$32
  Bottom 0.406: LED6.A 46.19,21.27 R6.1
N$33
  Bottom 0.406: LED7.A 36.03,21.27 R7.1
N$34
  Bottom 0.406: LED8.A 25.63,21.27 R8.1
N$35  (1 unrouted)
N$36  (1 unrouted)
N$37  (1 unrouted)
N$38  (2 unrouted)
N$39  (1 unrouted)
N$40  (1 unrouted)
N$41
  Top 0.406: 66.41,10.16 R45.1 | 66.41,10.16 R17.2 | S4.2 66.25,10 66.41,10.16
N$42  (2 unrouted)
N$43
  Top 0.406: R35.1 126.96,35.14 LED9.A
N$44
  Top 0.406: 76.57,10.16 R44.1 | 76.57,10.16 R16.2 | S3.2 76.41,10 76.57,10.16
N$45
  Top 0.406: 86.73,10.16 R15.2 | 86.73,10.16 R43.1 | 86.73,10.16 81.87,10.16 S2.2
N$46
  Top 0.406: U$1.21 R52.2
N$47
  Top 0.305: IC4.5 135.47,24.8 R50.1
N$48
  Top 0.305: R51.2 U$1.25
N$50
  Bottom 0.305: C15.2 72.12,80.01 72.76,80.64 76.57,80.64 77.34,79.88 IC1.2
N$51  (2 unrouted)
N$53
  Top 0.406: U$1.22 R53.2
N$55  (1 unrouted)
N$56  (1 unrouted)
N$57  (1 unrouted)
N$58  (1 unrouted)
N$59  (1 unrouted)
N$61  (1 unrouted)
NAME  (1 unrouted)
OC0  (1 unrouted)
OC1  (1 unrouted)
OUT+5V
  Top 1.016: SR(5V).TAB SR(5V).2 10.55,80.66 10.55,84.39 K1.14 11.25,86.98 13.23,88.96 15.1,88.96 C2.+
P1.0
  Top 0.406: R14.1 99.43,2.54 100.7,1.27 157.85,1.27 159.12,2.54 159.12,29.21 157.24,31.09 U$1.12
P1.1
  Top 0.406: R15.1 87.58,13.55 88,13.97 96.89,13.97 101.33,9.53 101.33,3.17 101.97,2.54 156.58,2.54 157.85,3.81 157.85,26.67 155.97,28.55 U$1.13
P1.2
  Top 0.406: R16.1 76.57,13.97 77.84,15.24 96.89,15.24 102.6,9.53 102.6,4.45 103.24,3.81 155.31,3.81 156.58,5.08 156.58,24.13 154.7,26.01 U$1.14
P1.3
  Top 0.406: R17.1 66.41,13.97 68.95,16.51 96.89,16.51 103.87,9.53 103.87,5.71 104.51,5.08 149.59,5.08 155.31,10.79 155.31,21.59 153.43,23.47 U$1.15
P1.4  (via drill 0.6)
  Top 0.406: C32.1 v57.52,12.7 R18.1
  Bottom 0.406: U$1.16 157.24,20.93 159.12,19.05 159.12,2.54 157.85,1.27 101.97,1.27 101.33,1.91 101.33,9.53 96.89,13.97 60.06,13.97 58.79,12.7 v57.52,12.7
P1.5  (via drill 0.6)
  Top 0.406: C31.1 v47.36,12.7 R19.1
  Bottom 0.406: v47.36,12.7 48.63,12.7 51.17,15.24 96.89,15.24 102.6,9.53 102.6,3.17 103.24,2.54 156.58,2.54 157.85,3.81 157.85,16.51 155.97,18.39 U$1.17
P1.6  (via drill 0.6)
  Top 0.406: v37.2,12.7 C30.1 R20.1
  Bottom 0.406: v37.2,12.7 38.47,12.7 42.28,16.51 96.89,16.51 103.87,9.53 103.87,4.45 104.51,3.81 155.31,3.81 156.58,5.08 156.58,15.24 155.31,16.51 143.88,16.51 142.21,18.18 U$1.18
P1.7  (via drill 0.6)
  Top 0.406: C29.1 v27.04,12.7 R21.1
  Bottom 0.406: v27.04,12.7 28.31,12.7 32.75,17.14 97.52,17.14 105.14,9.53 105.14,5.71 105.78,5.08 137.53,5.08 139.67,7.22 U$1.19
P3.2_PWM  (1 unrouted)
P4.0  (via drill 0.6)  (1 unrouted)
  Top 0.406: v147.69,78.74 140.81,78.74 R26.16
  Bottom 0.406: D10.3 147.52,78.57 v147.69,78.74 | R1.2 97.74,22.18 U$1.36
P4.1  (via drill 0.6)  (1 unrouted)
  Top 0.406: v148.96,83.82 146.42,83.82 145.15,82.55 141.34,82.55 139.11,80.32 R26.15
  Bottom 0.406: v148.96,83.82 D11.3 | R2.2 89.27,21.59 91.81,24.13 96.89,24.13 103.85,31.09 U$1.37
P4.2  (via drill 0.6)  (1 unrouted)
  Top 0.406: v143.88,76.2 140.7,76.2 139.43,77.47 138.8,77.47 137.84,78.43 R26.14
  Bottom 0.406: v143.88,76.2 D12.3 | R3.2 79.11,21.59 81.65,24.13 89.27,24.13 90.54,25.4 95.88,25.4 U$1.38
P4.3  (via drill 0.6)  (1 unrouted)
  Top 0.406: v143.88,83.82 140.7,83.82 139.43,82.55 137.53,82.55 136.57,81.59 R26.13
  Bottom 0.406: v143.88,83.82 D13.3 | U$1.39 95.88,27.94 74.03,27.94 67.68,21.59 R4.2
P4.4  (via drill 0.6)  (1 unrouted)
  Top 0.406: v138.8,76.2 136.26,76.2 135.3,77.16 R26.12
  Bottom 0.406: D14.3 v138.8,76.2 | R5.2 58.79,21.59 61.33,24.13 68.95,24.13 74.03,29.21 94.61,29.21 U$1.40
P4.5  (via drill 0.6)  (1 unrouted)
  Top 0.406: v138.8,83.82 136.26,83.82 134.03,81.59 R26.11
  Bottom 0.406: v138.8,83.82 D15.3 | R6.2 49.9,21.59 53.71,25.4 68.95,25.4 74.03,30.48 93.34,30.48 U$1.41
P4.6  (via drill 0.6)  (1 unrouted)
  Top 0.406: R26.10 132.76,77.16 v133.72,76.2
  Bottom 0.406: D16.3 v133.72,76.2 | R7.2 39.74,21.59 44.82,26.67 68.95,26.67 74.03,31.75 92.07,31.75 U$1.42
P4.7  (via drill 0.6)  (1 unrouted)
  Top 0.406: v133.72,83.82 133.72,82.55 131.49,80.32 R26.9
  Bottom 0.406: v133.72,83.82 D17.3 | R8.2 28.96,21.6 30.85,23.5 40.37,23.5 44.82,27.94 68.95,27.94 74.03,33.02 90.8,33.02 U$1.43
PWR-5
  Top 1.016: SR(5V).3 7.99,86.36 13.79,92.16 K1.2 | K1.2 C1.+ | K1.2 13.79,96.73 14.01,96.95 15.84,96.95 D1.C
R1IN
  Bottom 0.305: IC1.13 76.04,89.04 RS232.3
R26.1
  Top 0.406: R26.1 140.38,88.63 D-SUB-25.1
R26.2
  Top 0.406: D-SUB-25.14 139.43,91.91 139.43,87 R26.2
R26.3
  Top 0.406: R26.3 137.84,88.86 D-SUB-25.2
R26.4
  Top 0.406: D-SUB-25.15 136.68,86.78 R26.4
R26.5  (1 unrouted)
  Top 0.406: R26.5 D-SUB-25.3
R26.6
  Top 0.406: D-SUB-25.16 133.91,86.79 R26.6
R26.7
  Top 0.406: R26.7 132.76,88.84 D-SUB-25.4
R26.8
  Top 0.406: D-SUB-25.17 131.14,87.02 R26.8
RX  (via drill 0.6)  (1 unrouted)
  Top 0.305: v83.99,90.67 81.62,90.67 v81.6,90.66
  Bottom 0.305: IC1.12 75.39,85.1 75.39,87.84 74.85,88.38 74.85,89.68 75.83,90.66 v81.6,90.66
  Bottom 0.406: v83.99,90.67 83.99,90.48 84.49,89.98 84.49,86.83 87.94,83.38
S10  (2 unrouted)
  Top 0.406: S11.P2 51.59,88.47 C37.2
SCL  (2 unrouted)
  Top 0.305: IC4.11 134.82,38.27 133.72,39.37 129.91,39.37 128.64,40.64 128.64,41.91 128.86,42.13 IC3.6
  Top 0.406: IC2.14 109.77,67.13 103.24,73.66 103.24,91.44 105.78,93.98 126.31,93.98 D-SUB-25.18
SCL_INT
  Bottom 0.406: R12.1 110.86,23.75 I2C.3 111.16,21.89 109.19,19.92 U$1.31
SDA  (2 unrouted)
  Top 0.305: IC3.5 133.5,40.86 135.47,38.89 IC4.10
  Top 0.406: IC2.15 109.77,65.86 101.97,73.66 101.97,91.44 105.78,95.25 127.37,95.25 129.91,92.71 129.91,89.24 D-SUB-25.5
SDA_INT  (1 unrouted)
  Bottom 0.406: R11.1 113.7,27.42 I2C.2 113.7,21.29 114.27,20.72 U$1.29
SIMO  (2 unrouted)
SOMI  (2 unrouted)
SPI_CS  (1 unrouted)
STE  (1 unrouted)
T1
  Bottom 0.406: T1.3 123.56,80.01 124.83,81.28 124.83,87.63 124.21,88.25 D-SUB-25.7
T1OUT
  Bottom 0.305: IC1.14 76.69,85.1 76.69,88.02 77.75,89.08 RS232.2
T2
  Bottom 0.406: D-SUB-25.20 122.83,85.75 T2.3
T3  (via drill 0.6)
  Top 0.406: D-SUB-25.8 121.44,81.7 v119.75,80.01
  Bottom 0.406: T3.3 v119.75,80.01
T4  (via drill 0.6)
  Top 0.406: D-SUB-25.21 120.06,85.4 v119.75,85.09
  Bottom 0.406: T4.3 v119.75,85.09
T5  (via drill 0.6)
  Top 0.406: v114.67,80.01 115.94,80.01 118.67,82.74 D-SUB-25.9
  Bottom 0.406: T5.3 v114.67,80.01
T6  (via drill 0.6)
  Top 0.406: v114.67,85.09 115.94,85.09 117.29,86.44 D-SUB-25.22
  Bottom 0.406: T6.3 v114.67,85.09
T7  (via drill 0.6)
  Top 0.406: D-SUB-25.10 115.9,87.59 114.67,86.36 113.4,86.36 112.13,85.09 112.13,82.55 v109.59,80.01
  Bottom 0.406: T7.3 v109.59,80.01
T8  (via drill 0.6)
  Top 0.406: v109.59,85.09 109.59,86.36 110.86,87.63 114.03,87.63 114.52,88.11 D-SUB-25.23
  Bottom 0.406: T8.3 v109.59,85.09
TX  (1 unrouted)
  Bottom 0.406: IC1.11 74.73,85.11 74.73,86.86 74.32,87.27 72.64,87.27 71.78,88.13 71.78,89.8 73.19,91.21 73.19,93.16 74.32,94.29 81.89,94.29 83.02,93.16 83.02,86.81 83.05,86.81 86.49,83.38
UCLK  (2 unrouted)
USB  (via drill 0.7)
  Top 1.016: K1.1 10.53,92.68 9.26,91.44 v9.26,90.3
  Bottom 1.27: v9.26,90.3 9.82,89.74 USB.2
V-
  Bottom 0.305: 72.88,76.56 72.88,74.93 72.03,74.08 C16.2 | IC1.6 74.74,78.18 74.13,77.57 73.3,77.57 72.88,77.15 72.88,76.56 | 72.88,76.56
VCC-EEPROM
  Top 0.406: C34.1 129.13,45.23 129.69,44.67 129.91,44.67 | 129.91,44.67 IC3.8 | S10.3 125.77,24.46 124.83,25.4 R35.2 124.41,33.44 123.56,34.29 123.56,36.83 127.37,40.64 127.37,42.13 129.91,44.67
VOUTA  (2 unrouted)
VOUTB  (2 unrouted)
VOUTC  (2 unrouted)
VOUTD  (2 unrouted)
WP  (1 unrouted)
WP5  (1 unrouted)

### Text on the board
Top: +5V | +5V | +3,3V | 3,3V | 64 | 1 | 2 | G.CASCINO | S10 | 16 | LED8 | BOCASboard | A.BODE | S8 | S7 | S6 | S5 | S4 | S3 | S2 | S1 | TOP
Bottom: | | + | | | +5V | 3,3V | GND | AGND | 49 | SCL | SDA | SPI_CS | 1 | UCLK | SOMI | 1 | SIMO | DGND | 2 | 3,3V | GND | GND | +5V | 32 | BOTTOM
tDocu: - | +